# Altium project ControllerBoardExp.PrjPCB
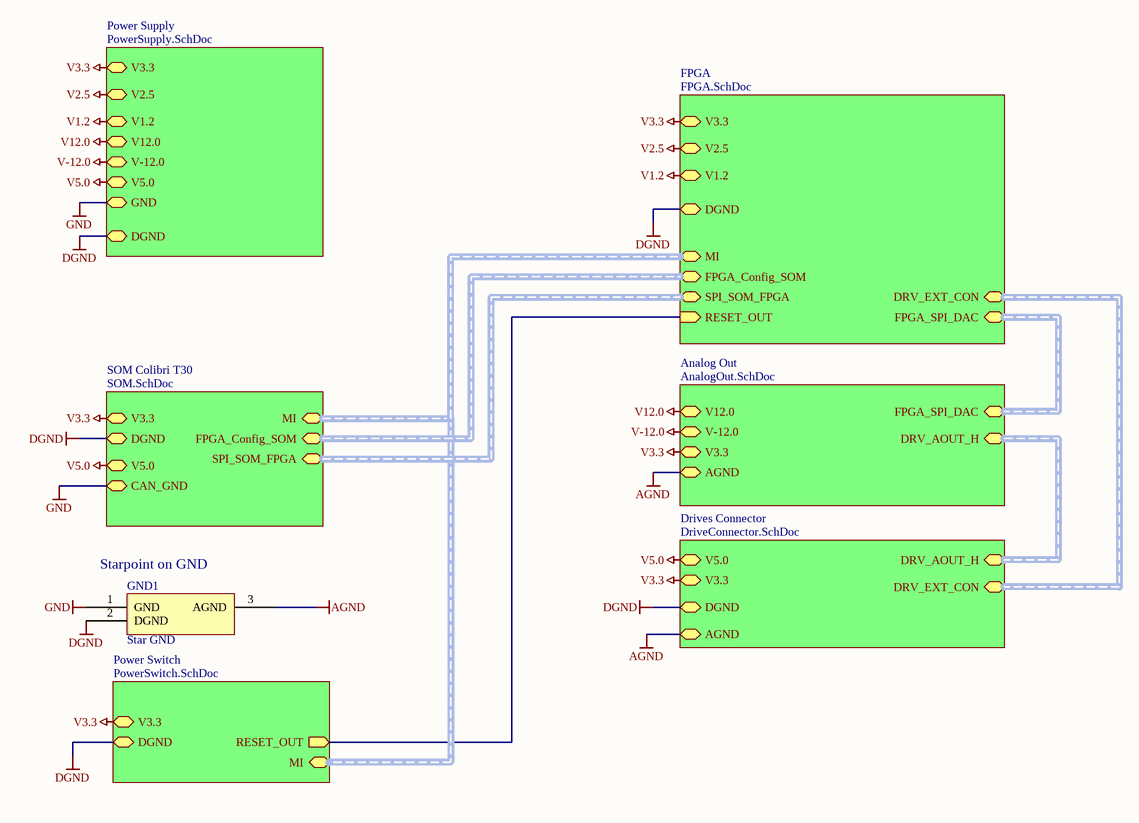
[diagram p0: ControllerBoardExp.SchDoc]
11 sheets, 166 parts. Net scope: strictly hierarchical (ports join the sheet entries above them; power ports are local).
Board file: ControllerBoardExp.PcbDoc
Sheets:
  ControllerBoardExp.SchDoc
    Power Supply = PowerSupply.SchDoc
    FPGA = FPGA.SchDoc
      FPGA_IO = FPGA_IO.SchDoc
      FPGA Config = FPGA_Config.SchDoc
    SOM Colibri T30 = SOM.SchDoc
      SOM CAN = SOM_CAN.SchDoc
      SOM USB = SOM_USB.SchDoc
    Analog Out = AnalogOut.SchDoc
      AnalogOut Level Shifter = AnalogOutLevelShifter.SchDoc
    Drives Connector = DriveConnector.SchDoc

## Sheet ControllerBoardExp.SchDoc: Main Schematic
size A4; Author: A. Kalberer; CompanyName: NTB; Organization: NTB Interstate University of Applied; Address1: Werdenbergstrasse 4; Address3: 9471 Buchs; Address4: Switzerland; Revision: 0.1; SheetNumber: 1; SheetTotal: 2; Organization1: Sciences of Technology Buchs; Size: A4

### Parts
GND1  Star GND  [NetTieGND]  (net tie, no BOM)

### Sub-sheets
Analog Out = AnalogOut.SchDoc: FPGA_SPI_DAC (harness FPGA_SPI_DAC), V12.0, V-12.0, AGND, V3.3, DRV_AOUT_H (harness DRV_AOUT_H)
Drives Connector = DriveConnector.SchDoc: DRV_EXT_CON (harness DRV_EXT_CON), DRV_AOUT_H (harness DRV_AOUT_H), V5.0, DGND, AGND, V3.3
FPGA = FPGA.SchDoc: V3.3, V2.5, V1.2, DGND (bidir), MI (harness MI), FPGA_Config_SOM (harness FPGA_Config_SOM), RESET_OUT (in), SPI_SOM_FPGA (harness SPI_SOM_FPGA), FPGA_SPI_DAC (harness FPGA_SPI_DAC), DRV_EXT_CON (harness DRV_EXT_CON)
Power Supply = PowerSupply.SchDoc: GND, V1.2, V2.5, V3.3, V5.0, V12.0, V-12.0, DGND
Power Switch = PowerSwitch.SchDoc (file not in this document): V3.3, DGND, MI (harness MI), RESET_OUT (out)
SOM Colibri T30 = SOM.SchDoc: V3.3, DGND (bidir), MI (harness MI), FPGA_Config_SOM (harness FPGA_Config_SOM), SPI_SOM_FPGA (harness SPI_SOM_FPGA), V5.0, CAN_GND

### Nets
AGND: GND1.3(AGND) ; sheet Analog Out/AGND, sheet Drives Connector/AGND
DGND: GND1.2(DGND) ; sheet Power Supply/DGND, sheet FPGA/DGND, sheet SOM Colibri T30/DGND, sheet Power Switch/DGND, sheet Drives Connector/DGND
GND: GND1.1(GND) ; sheet Power Supply/GND, sheet SOM Colibri T30/CAN_GND  [project net CAN_GND]
V1.2: sheet Power Supply/V1.2, sheet FPGA/V1.2
V2.5: sheet Power Supply/V2.5, sheet FPGA/V2.5
V3.3: sheet Power Supply/V3.3, sheet FPGA/V3.3, sheet SOM Colibri T30/V3.3, sheet Power Switch/V3.3, sheet Analog Out/V3.3, sheet Drives Connector/V3.3
V5.0: sheet Power Supply/V5.0, sheet SOM Colibri T30/V5.0, sheet Drives Connector/V5.0
V12.0: sheet Power Supply/V12.0, sheet Analog Out/V12.0
V-12.0: sheet Power Supply/V-12.0, sheet Analog Out/V-12.0
RESET_OUT: sheet FPGA/RESET_OUT, sheet Power Switch/RESET_OUT

### Buses and harness runs
harness sheet Analog Out/DRV_AOUT_H = sheet Drives Connector/DRV_AOUT_H
harness sheet Analog Out/FPGA_SPI_DAC = sheet FPGA/FPGA_SPI_DAC
harness sheet Drives Connector/DRV_EXT_CON = sheet FPGA/DRV_EXT_CON
harness sheet FPGA/FPGA_Config_SOM = sheet SOM Colibri T30/FPGA_Config_SOM
harness sheet FPGA/MI = sheet Power Switch/MI = sheet SOM Colibri T30/MI
harness sheet FPGA/SPI_SOM_FPGA = sheet SOM Colibri T30/SPI_SOM_FPGA

### Notes on the sheet
- (near GND1) Starpoint on GND
- Title:
- Description:
- Size:
- Date:
- Name:
- Number:
- Time:
- Revision:
- Sheet
- Checked:
- of
- File:

### Library data of the parts
GND1 = NetTie

## Sheet PowerSupply.SchDoc: Power Supply Main PCB
size A4; Author: A. Kalberer; CompanyName: NTB; Organization: NTB Interstate University of Applied; Address1: Werdenbergstrasse 4; Address3: 9471 Buchs; Address4: Switzerland; Revision: 0.1; SheetNumber: 2; SheetTotal: 2; Organization1: Sciences of Technology Buchs; Size: A4; ShortDescription: Power Supply
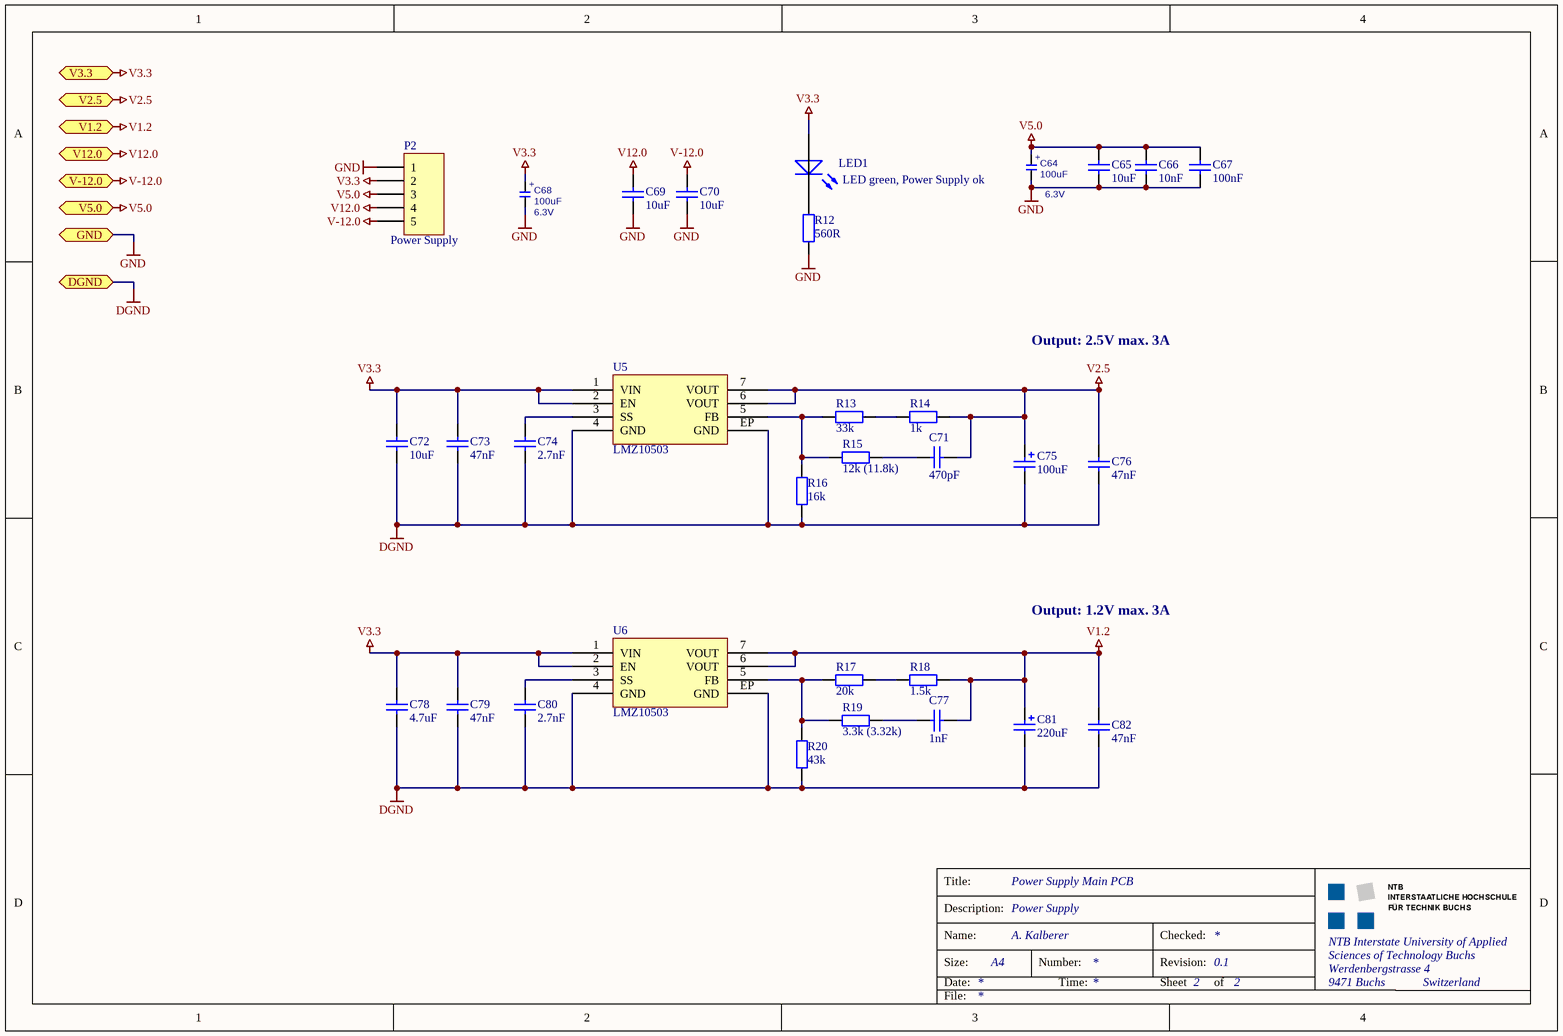
[diagram p1: PowerSupply.SchDoc]

### Parts
C64  Rating: 6.3V  [1206_Pol]  (hidden comment: 100uF)
C65  10uF  [1206]
C66  10nF  [0603_3D]
C67  100nF  [0603_3D]
C68  Rating: 6.3V  [1206_Pol]  (hidden comment: 100uF)
C69  10uF  [1206]
C70  10uF  [1206]
C71  470pF  [0603_3D]
C72  10uF  [1206]
C73  47nF  [0603_3D]
C74  2.7nF  [0603_3D]
C75  100uF  [1812_Pol]
C76  47nF  [0603_3D]
C77  1nF  [0603_3D]
C78  4.7uF  [1206]
C79  47nF  [0603_3D]
C80  2.7nF  [0603_3D]
C81  220uF  [CC-Type-B-3528]
C82  47nF  [0603_3D]
LED1  LED green, Power Supply ok  [0805]
P2  Power Supply  [Header - 1x5 - H]
R12  560R  [0603_3D]
R13  33k  [0603_3D]
R14  1k  [0603_3D]
R15  12k (11.8k)  [0603_3D]
R16  16k  [0603_3D]
R17  20k  [0603_3D]
R18  1.5k  [0603_3D]
R19  3.3k (3.32k)  [0603_3D]
R20  43k  [0603_3D]
U5  LMZ10503  [TZA07A]
U6  LMZ10503  [TZA07A]

### Ports
DGND, GND, V1.2, V2.5, V3.3, V5.0, V12.0, V-12.0

### Nets
DGND: C72.1 C73.1 C74.1 C75.2(Neg) C76.1 C78.1 C79.1 C80.1 C81.2(Neg) C82.1 R16.2 R20.2 U5.4(GND) U5.EP(GND) U6.4(GND) U6.EP(GND) ; port DGND
GND: C64.2 C65.1 C66.1 C67.1 C68.2 C69.1 C70.1 P2.1 R12.1 ; port GND  [project net CAN_GND]
V1.2: C77.1 C81.1(Pos) C82.2 R18.2 U6.6(VOUT) U6.7(VOUT) ; port V1.2
V2.5: C71.1 C75.1(Pos) C76.2 R14.2 U5.6(VOUT) U5.7(VOUT) ; port V2.5
V3.3: C68.1 C72.2 C73.2 C78.2 C79.2 LED1.2(A) P2.2 U5.1(VIN) U5.2(EN) U6.1(VIN) U6.2(EN) ; port V3.3
V5.0: C64.1 C65.2 C66.2 C67.2 P2.3 ; port V5.0
V12.0: C69.2 P2.4 ; port V12.0
V-12.0: C70.2 P2.5 ; port V-12.0
NetC71_2: C71.2 R15.2
NetC74_2: C74.2 U5.3(SS)
NetC77_2: C77.2 R19.2
NetC80_2: C80.2 U6.3(SS)
NetLED1_1: LED1.1(K) R12.2
NetR13_1: R13.1 R15.1 R16.1 U5.5(FB)
NetR13_2: R13.2 R14.1
NetR17_1: R17.1 R19.1 R20.1 U6.5(FB)
NetR17_2: R17.2 R18.1

### Notes on the sheet
- Output: 2.5V max. 3A
- Output: 1.2V max. 3A
- Title:
- Description:
- Size:
- Date:
- Name:
- Number:
- Time:
- Revision:
- Sheet
- Checked:
- of
- File:
- (in symbol C-TA-100uF-10V-20%-3528) +

### Library data of the parts
C64 C68 = C-TA-100uF-10V-20%-3528: Capacitor TA 100uF 10V 20% 3528; Manufacturer: Generic; Tolerance: 20%; Type: TA; Value: 100uF; Manufacturer Part Number: *
C65 C69 C70 C72 C78 = C: Capacitor; #Manufacturer: Generic Components; #Publisher: Dr. A. Heinzelmann; #Class: Passive; Initial Voltage: 0V; Type: Ceramic; #Published: 2006-10-07; #ClassSub: Capacitor; Voltage Maximum: *
  C65 C69 C70 C72: Value: 10uF
  C78: Value: 4.7uF
C66 C67 C71 C73 C74 C76 C77 C79 C80 C82 = C: Capacitor; #Manufacturer: Generic Components; #Publisher: Dr. A. Heinzelmann; #Class: Passive; Initial Voltage: 0V; #Published: 2006-10-07; #ClassSub: Capacitor; Type: *; Voltage Maximum: *
  C66: Value: 10nF
  C67: Value: 100nF
  C71: Value: 470pF
  C73 C76 C79 C82: Value: 47nF
  C74 C80: Value: 2.7nF
  C77: Value: 1nF
C75 C81 = C_POL: Polarized Capacitor Positive Mark Bar; #Manufacturer: Generic Components; #Publisher: Dr. A. Heinzelmann; #Class: Passive; Initial Voltage: 0V; Type: Tantal; #Published: 2006-10-07; #ClassSub: Capacitor; Voltage Maxium: *
  C75: Value: 100uF
  C81: Value: 220uF
LED1 = LED: Typical RED, GREEN, YELLOW, AMBER GaAs LED; #Manufacturer: Generic Components; #Publisher: Dr. A. Heinzelmann; #Class: Optoelectronic; #Published: 2006-10-31; #ClassSub: LED; Color: *; Type: *
P2 = Header 1x5: Header, 5-Pin; LatestRevisionDate: 17-Jul-2002; LatestRevisionNote: Re-released for DXP Platform.; Publisher: Altium Limited
R12-R20 = R: Resistor; #Manufacturer: Generic Components; #Publisher: Dr. A. Heinzelmann; #Class: Passive; #Published: 2006-10-06; #ClassSub: Resistor; Type: *
  R12: Value: 560R
  R13: Value: 33k
  R14: Value: 1k
  R15: Value: 12k (11.8k)
  R16: Value: 16k
  R17: Value: 20k
  R18: Value: 1.5k
  R19: Value: 3.3k (3.32k)
  R20: Value: 43k
U5 U6 = LMZ10503: Buck Converter

## Sheet FPGA.SchDoc: FPGA Overview
size A4; Author: A. Kalberer; CompanyName: NTB; Organization: NTB Interstate University of Applied; Address1: Werdenbergstrasse 4; Address3: 9471 Buchs; Address4: Switzerland; Revision: 0.1; Organization1: Sciences of Technology Buchs; Size: A4
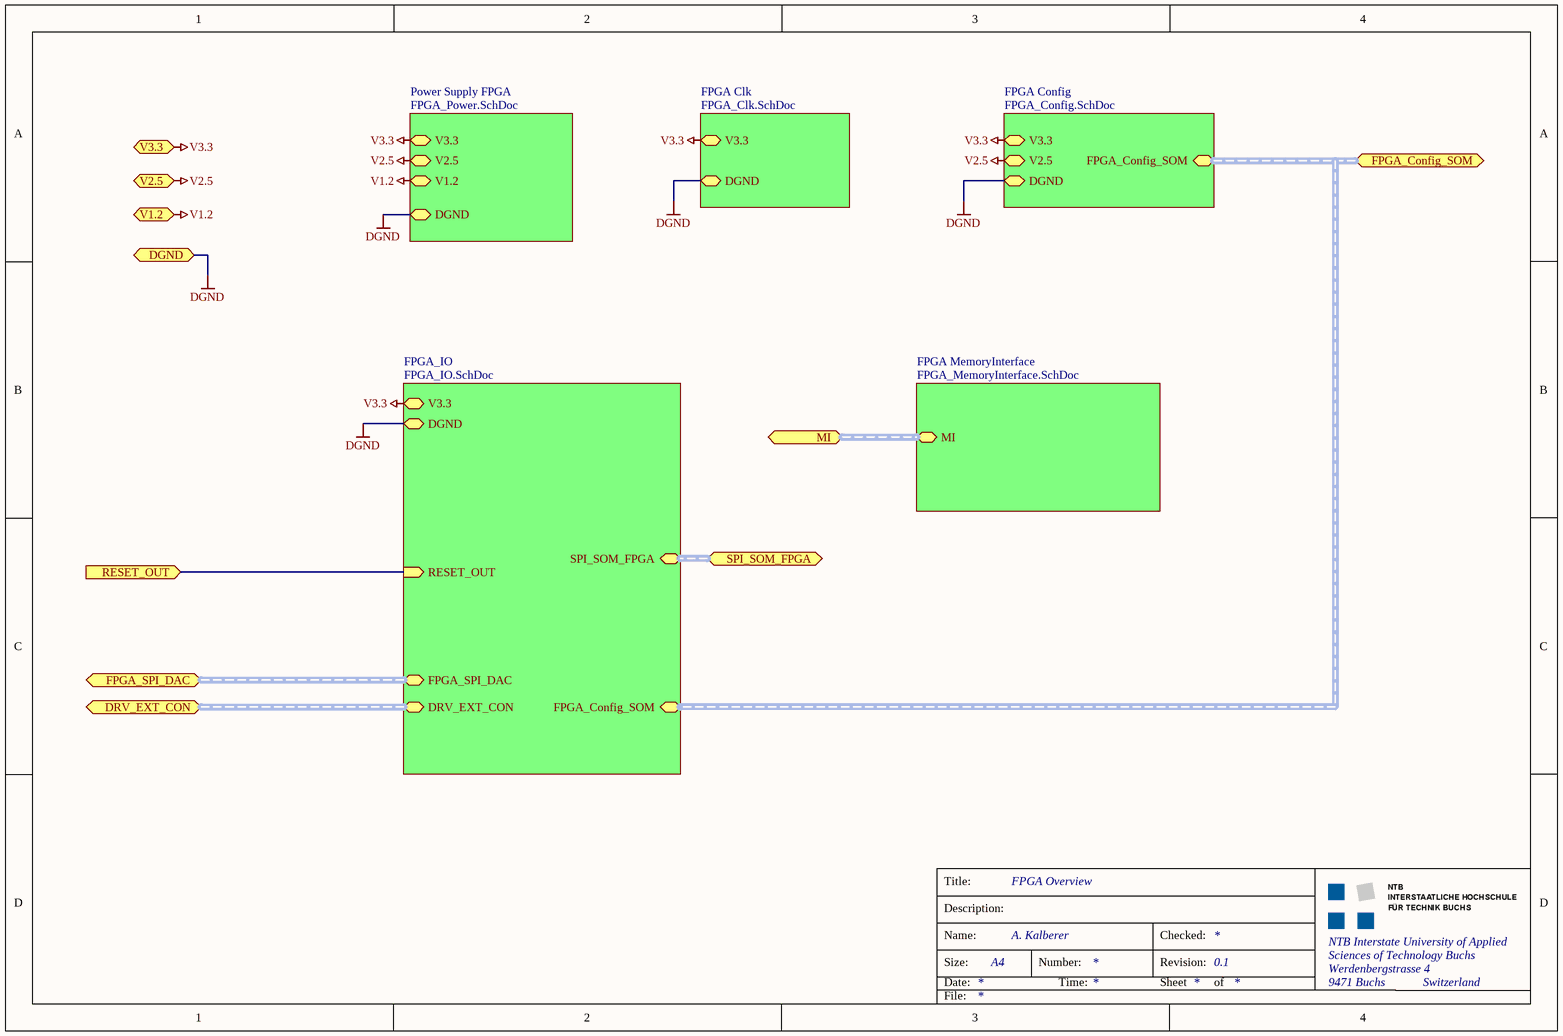
[diagram p2: FPGA.SchDoc]

### Sub-sheets
FPGA Clk = FPGA_Clk.SchDoc (file not in this document): V3.3, DGND
FPGA Config = FPGA_Config.SchDoc: V3.3, DGND, V2.5, FPGA_Config_SOM (harness FPGA_Config_SOM)
FPGA MemoryInterface = FPGA_MemoryInterface.SchDoc (file not in this document): MI (harness MI)
FPGA_IO = FPGA_IO.SchDoc: RESET_OUT (in), SPI_SOM_FPGA (harness SPI_SOM_FPGA), FPGA_Config_SOM (harness FPGA_Config_SOM), FPGA_SPI_DAC (harness FPGA_SPI_DAC), V3.3, DGND, DRV_EXT_CON (harness DRV_EXT_CON)
Power Supply FPGA = FPGA_Power.SchDoc (file not in this document): V3.3, V2.5, V1.2, DGND

### Ports
DGND, DRV_EXT_CON (harness DRV_EXT_CON), FPGA_Config_SOM (harness FPGA_Config_SOM), FPGA_SPI_DAC (harness FPGA_SPI_DAC), MI (harness MI), RESET_OUT (in), SPI_SOM_FPGA (harness SPI_SOM_FPGA), V1.2, V2.5, V3.3

### Nets
DGND: port DGND, sheet Power Supply FPGA/DGND, sheet FPGA Clk/DGND, sheet FPGA_IO/DGND, sheet FPGA Config/DGND
V1.2: port V1.2, sheet Power Supply FPGA/V1.2
V2.5: port V2.5, sheet Power Supply FPGA/V2.5, sheet FPGA Config/V2.5
V3.3: port V3.3, sheet Power Supply FPGA/V3.3, sheet FPGA Clk/V3.3, sheet FPGA_IO/V3.3, sheet FPGA Config/V3.3
RESET_OUT: port RESET_OUT, sheet FPGA_IO/RESET_OUT

### Buses and harness runs
harness port DRV_EXT_CON = sheet FPGA_IO/DRV_EXT_CON
harness port FPGA_Config_SOM = sheet FPGA Config/FPGA_Config_SOM = sheet FPGA_IO/FPGA_Config_SOM
harness port FPGA_SPI_DAC = sheet FPGA_IO/FPGA_SPI_DAC
harness port MI = sheet FPGA MemoryInterface/MI
harness port SPI_SOM_FPGA = sheet FPGA_IO/SPI_SOM_FPGA

### Notes on the sheet
- Title:
- Description:
- Size:
- Date:
- Name:
- Number:
- Time:
- Revision:
- Sheet
- Checked:
- of
- File:

## Sheet FPGA_IO.SchDoc: FPGA IO
size A3; Author: A. Kalberer; CompanyName: NTB; Organization: NTB Interstate University of Applied; Address1: Werdenbergstrasse 4; Address3: 9471 Buchs; Address4: Switzerland; Organization1: Sciences of Technology Buchs; Size: A3
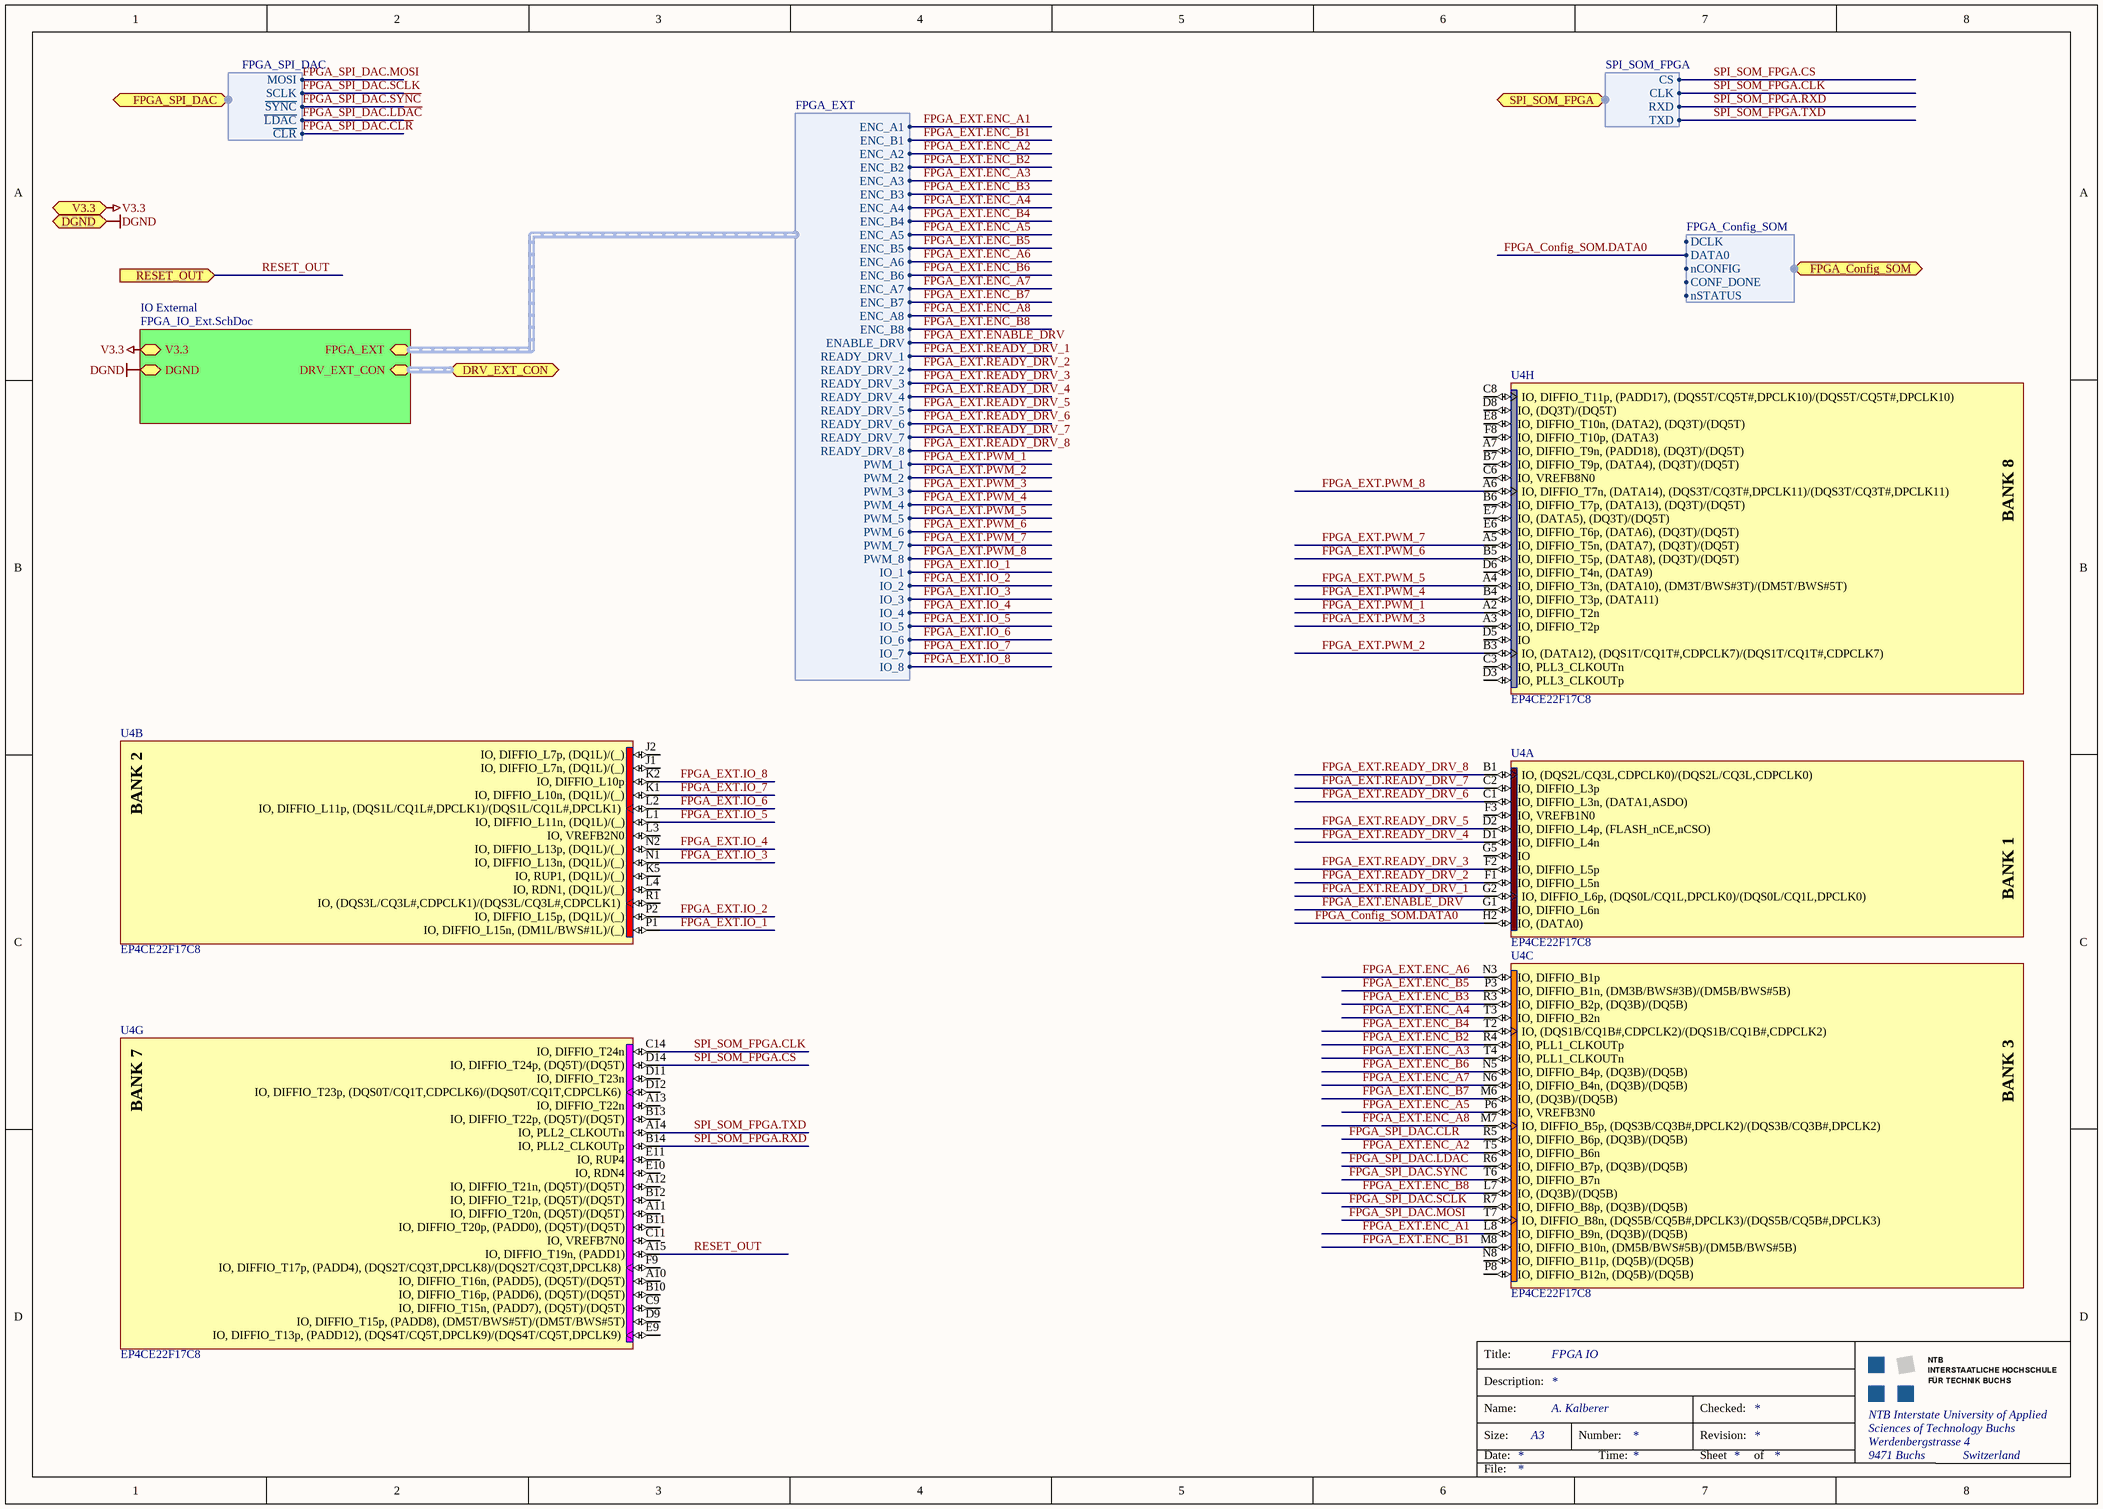
[diagram p3: FPGA_IO.SchDoc]

### Parts
U4  EP4CE22F17C8  [FBGA256]  (parts A,B,C,G,H of 13)

### Sub-sheets
IO External = FPGA_IO_Ext.SchDoc (file not in this document): V3.3, DGND, FPGA_EXT (harness FPGA_EXT), DRV_EXT_CON (harness DRV_EXT_CON)

### Ports
DGND, DRV_EXT_CON (harness DRV_EXT_CON), FPGA_Config_SOM (harness FPGA_Config_SOM), FPGA_SPI_DAC (harness FPGA_SPI_DAC), RESET_OUT (in), SPI_SOM_FPGA (harness SPI_SOM_FPGA), V3.3

### Harnesses
SPI_SOM_FPGA: CS, CLK, RXD, TXD
FPGA_Config_SOM: DCLK, DATA0, nCONFIG, CONF_DONE, nSTATUS
FPGA_SPI_DAC: MOSI, SCLK, ~{SYNC}, ~{LDAC}, ~{CLR}
FPGA_EXT: ENC_A1, ENC_B1, ENC_A2, ENC_B2, ENC_A3, ENC_B3, ENC_A4, ENC_B4, PWM_1, ENABLE_DRV, READY_DRV_4, READY_DRV_3, READY_DRV_2, READY_DRV_1, IO_1, IO_2, ENC_A5, ENC_B5, ENC_A6, ENC_B6, ENC_A7, ENC_B7, ENC_A8, ENC_B8, READY_DRV_5, READY_DRV_6, READY_DRV_7, READY_DRV_8, PWM_2, PWM_3, PWM_4, PWM_5, PWM_6, PWM_7, PWM_8, IO_3, IO_4, IO_5, IO_6, IO_7, IO_8

### Nets
DGND: port DGND, sheet IO External/DGND
V3.3: port V3.3, sheet IO External/V3.3
FPGA_Config_SOM.DATA0: U4.H2(IO,_(DATA0)) ; port FPGA_Config_SOM.DATA0
FPGA_EXT.ENABLE_DRV: U4.G1(IO,_DIFFIO_L6n) ; sheet IO External/FPGA_EXT.ENABLE_DRV
FPGA_EXT.ENC_A1: U4.L8(IO,_DIFFIO_B9n,_(DQ3B)/(DQ5B)) ; sheet IO External/FPGA_EXT.ENC_A1
FPGA_EXT.ENC_A2: U4.T5(IO,_DIFFIO_B6n) ; sheet IO External/FPGA_EXT.ENC_A2
FPGA_EXT.ENC_A3: U4.T4(IO,_PLL1_CLKOUTn) ; sheet IO External/FPGA_EXT.ENC_A3
FPGA_EXT.ENC_A4: U4.T3(IO,_DIFFIO_B2n) ; sheet IO External/FPGA_EXT.ENC_A4
FPGA_EXT.ENC_A5: U4.P6(IO,_VREFB3N0) ; sheet IO External/FPGA_EXT.ENC_A5
FPGA_EXT.ENC_A6: U4.N3(IO,_DIFFIO_B1p) ; sheet IO External/FPGA_EXT.ENC_A6
FPGA_EXT.ENC_A7: U4.N6(IO,_DIFFIO_B4n,_(DQ3B)/(DQ5B)) ; sheet IO External/FPGA_EXT.ENC_A7
FPGA_EXT.ENC_A8: U4.M7(IO,_DIFFIO_B5p,_(DQS3B/CQ3B#,DPCLK2)/(DQS3B/CQ3B#,DPCLK2)) ; sheet IO External/FPGA_EXT.ENC_A8
FPGA_EXT.ENC_B1: U4.M8(IO,_DIFFIO_B10n,_(DM5B/BWS#5B)/(DM5B/BWS#5B)) ; sheet IO External/FPGA_EXT.ENC_B1
FPGA_EXT.ENC_B2: U4.R4(IO,_PLL1_CLKOUTp) ; sheet IO External/FPGA_EXT.ENC_B2
FPGA_EXT.ENC_B3: U4.R3(IO,_DIFFIO_B2p,_(DQ3B)/(DQ5B)) ; sheet IO External/FPGA_EXT.ENC_B3
FPGA_EXT.ENC_B4: U4.T2(IO,_(DQS1B/CQ1B#,CDPCLK2)/(DQS1B/CQ1B#,CDPCLK2)) ; sheet IO External/FPGA_EXT.ENC_B4
FPGA_EXT.ENC_B5: U4.P3(IO,_DIFFIO_B1n,_(DM3B/BWS#3B)/(DM5B/BWS#5B)) ; sheet IO External/FPGA_EXT.ENC_B5
FPGA_EXT.ENC_B6: U4.N5(IO,_DIFFIO_B4p,_(DQ3B)/(DQ5B)) ; sheet IO External/FPGA_EXT.ENC_B6
FPGA_EXT.ENC_B7: U4.M6(IO,_(DQ3B)/(DQ5B)) ; sheet IO External/FPGA_EXT.ENC_B7
FPGA_EXT.ENC_B8: U4.L7(IO,_(DQ3B)/(DQ5B)) ; sheet IO External/FPGA_EXT.ENC_B8
FPGA_EXT.IO_1: U4.P1(IO,_DIFFIO_L15n,_(DM1L/BWS#1L)/(_)) ; sheet IO External/FPGA_EXT.IO_1
FPGA_EXT.IO_2: U4.P2(IO,_DIFFIO_L15p,_(DQ1L)/(_)) ; sheet IO External/FPGA_EXT.IO_2
FPGA_EXT.IO_3: U4.N1(IO,_DIFFIO_L13n,_(DQ1L)/(_)) ; sheet IO External/FPGA_EXT.IO_3
FPGA_EXT.IO_4: U4.N2(IO,_DIFFIO_L13p,_(DQ1L)/(_)) ; sheet IO External/FPGA_EXT.IO_4
FPGA_EXT.IO_5: U4.L1(IO,_DIFFIO_L11n,_(DQ1L)/(_)) ; sheet IO External/FPGA_EXT.IO_5
FPGA_EXT.IO_6: U4.L2(IO,_DIFFIO_L11p,_(DQS1L/CQ1L#,DPCLK1)/(DQS1L/CQ1L#,DPCLK1)) ; sheet IO External/FPGA_EXT.IO_6
FPGA_EXT.IO_7: U4.K1(IO,_DIFFIO_L10n,_(DQ1L)/(_)) ; sheet IO External/FPGA_EXT.IO_7
FPGA_EXT.IO_8: U4.K2(IO,_DIFFIO_L10p) ; sheet IO External/FPGA_EXT.IO_8
FPGA_EXT.PWM_1: U4.A2(IO,_DIFFIO_T2n) ; sheet IO External/FPGA_EXT.PWM_1
FPGA_EXT.PWM_2: U4.B3(IO,_(DATA12),_(DQS1T/CQ1T#,CDPCLK7)/(DQS1T/CQ1T#,CDPCLK7)) ; sheet IO External/FPGA_EXT.PWM_2
FPGA_EXT.PWM_3: U4.A3(IO,_DIFFIO_T2p) ; sheet IO External/FPGA_EXT.PWM_3
FPGA_EXT.PWM_4: U4.B4(IO,_DIFFIO_T3p,_(DATA11)) ; sheet IO External/FPGA_EXT.PWM_4
FPGA_EXT.PWM_5: U4.A4(IO,_DIFFIO_T3n,_(DATA10),_(DM3T/BWS#3T)/(DM5T/BWS#5T)) ; sheet IO External/FPGA_EXT.PWM_5
FPGA_EXT.PWM_6: U4.B5(IO,_DIFFIO_T5p,_(DATA8),_(DQ3T)/(DQ5T)) ; sheet IO External/FPGA_EXT.PWM_6
FPGA_EXT.PWM_7: U4.A5(IO,_DIFFIO_T5n,_(DATA7),_(DQ3T)/(DQ5T)) ; sheet IO External/FPGA_EXT.PWM_7
FPGA_EXT.PWM_8: U4.A6(IO,_DIFFIO_T7n,_(DATA14),_(DQS3T/CQ3T#,DPCLK11)/(DQS3T/CQ3T#,DPCLK11)) ; sheet IO External/FPGA_EXT.PWM_8
FPGA_EXT.READY_DRV_1: U4.G2(IO,_DIFFIO_L6p,_(DQS0L/CQ1L,DPCLK0)/(DQS0L/CQ1L,DPCLK0)) ; sheet IO External/FPGA_EXT.READY_DRV_1
FPGA_EXT.READY_DRV_2: U4.F1(IO,_DIFFIO_L5n) ; sheet IO External/FPGA_EXT.READY_DRV_2
FPGA_EXT.READY_DRV_3: U4.F2(IO,_DIFFIO_L5p) ; sheet IO External/FPGA_EXT.READY_DRV_3
FPGA_EXT.READY_DRV_4: U4.D1(IO,_DIFFIO_L4n) ; sheet IO External/FPGA_EXT.READY_DRV_4
FPGA_EXT.READY_DRV_5: U4.D2(IO,_DIFFIO_L4p,_(FLASH_nCE,nCSO)) ; sheet IO External/FPGA_EXT.READY_DRV_5
FPGA_EXT.READY_DRV_6: U4.C1(IO,_DIFFIO_L3n,_(DATA1,ASDO)) ; sheet IO External/FPGA_EXT.READY_DRV_6
FPGA_EXT.READY_DRV_7: U4.C2(IO,_DIFFIO_L3p) ; sheet IO External/FPGA_EXT.READY_DRV_7
FPGA_EXT.READY_DRV_8: U4.B1(IO,_(DQS2L/CQ3L,CDPCLK0)/(DQS2L/CQ3L,CDPCLK0)) ; sheet IO External/FPGA_EXT.READY_DRV_8
FPGA_SPI_DAC.~{CLR}: U4.R5(IO,_DIFFIO_B6p,_(DQ3B)/(DQ5B)) ; port FPGA_SPI_DAC.~{CLR}
FPGA_SPI_DAC.~{LDAC}: U4.R6(IO,_DIFFIO_B7p,_(DQ3B)/(DQ5B)) ; port FPGA_SPI_DAC.~{LDAC}
FPGA_SPI_DAC.MOSI: U4.T7(IO,_DIFFIO_B8n,_(DQS5B/CQ5B#,DPCLK3)/(DQS5B/CQ5B#,DPCLK3)) ; port FPGA_SPI_DAC.MOSI
FPGA_SPI_DAC.~{SYNC}: U4.T6(IO,_DIFFIO_B7n) ; port FPGA_SPI_DAC.~{SYNC}
FPGA_SPI_DAC.SCLK: U4.R7(IO,_DIFFIO_B8p,_(DQ3B)/(DQ5B)) ; port FPGA_SPI_DAC.SCLK
RESET_OUT: U4.A15(IO,_DIFFIO_T19n,_(PADD1)) ; port RESET_OUT
SPI_SOM_FPGA.CLK: U4.C14(IO,_DIFFIO_T24n) ; port SPI_SOM_FPGA.CLK
SPI_SOM_FPGA.CS: U4.D14(IO,_DIFFIO_T24p,_(DQ5T)/(DQ5T)) ; port SPI_SOM_FPGA.CS
SPI_SOM_FPGA.RXD: U4.B14(IO,_PLL2_CLKOUTp) ; port SPI_SOM_FPGA.RXD
SPI_SOM_FPGA.TXD: U4.A14(IO,_PLL2_CLKOUTn) ; port SPI_SOM_FPGA.TXD

Not connected (* = marked no-connect by the designer): U4 A7(IO,_DIFFIO_T9n,_(PADD18),_(DQ3T)/(DQ5T)) A10(IO,_DIFFIO_T16n,_(PADD5),_(DQ5T)/(DQ5T)) A11(IO,_DIFFIO_T20n,_(DQ5T)/(DQ5T)) A12(IO,_DIFFIO_T21n,_(DQ5T)/(DQ5T)) A13(IO,_DIFFIO_T22n) B6(IO,_DIFFIO_T7p,_(DATA13),_(DQ3T)/(DQ5T)) B7(IO,_DIFFIO_T9p,_(DATA4),_(DQ3T)/(DQ5T)) B10(IO,_DIFFIO_T16p,_(PADD6),_(DQ5T)/(DQ5T)) B11(IO,_DIFFIO_T20p,_(PADD0),_(DQ5T)/(DQ5T)) B12(IO,_DIFFIO_T21p,_(DQ5T)/(DQ5T)) B13(IO,_DIFFIO_T22p,_(DQ5T)/(DQ5T)) C3(IO,_PLL3_CLKOUTn) C6(IO,_VREFB8N0) C8(IO,_DIFFIO_T11p,_(PADD17),_(DQS5T/CQ5T#,DPCLK10)/(DQS5T/CQ5T#,DPCLK10)) C9(IO,_DIFFIO_T15n,_(PADD7),_(DQ5T)/(DQ5T)) C11(IO,_VREFB7N0) D3(IO,_PLL3_CLKOUTp) D5(IO) D6(IO,_DIFFIO_T4n,_(DATA9)) D8(IO,_(DQ3T)/(DQ5T)) D9(IO,_DIFFIO_T15p,_(PADD8),_(DM5T/BWS#5T)/(DM5T/BWS#5T)) D11(IO,_DIFFIO_T23n) D12(IO,_DIFFIO_T23p,_(DQS0T/CQ1T,CDPCLK6)/(DQS0T/CQ1T,CDPCLK6)) E6(IO,_DIFFIO_T6p,_(DATA6),_(DQ3T)/(DQ5T)) E7(IO,_(DATA5),_(DQ3T)/(DQ5T)) E8(IO,_DIFFIO_T10n,_(DATA2),_(DQ3T)/(DQ5T)) E9(IO,_DIFFIO_T13p,_(PADD12),_(DQS4T/CQ5T,DPCLK9)/(DQS4T/CQ5T,DPCLK9)) E10(IO,_RDN4) E11(IO,_RUP4) F3(IO,_VREFB1N0) F8(IO,_DIFFIO_T10p,_(DATA3)) F9(IO,_DIFFIO_T17p,_(PADD4),_(DQS2T/CQ3T,DPCLK8)/(DQS2T/CQ3T,DPCLK8)) G5(IO) J1(IO,_DIFFIO_L7n,_(DQ1L)/(_)) J2(IO,_DIFFIO_L7p,_(DQ1L)/(_)) K5(IO,_RUP1,_(DQ1L)/(_)) L3(IO,_VREFB2N0) L4(IO,_RDN1,_(DQ1L)/(_)) N8(IO,_DIFFIO_B11p,_(DQ5B)/(DQ5B)) P8(IO,_DIFFIO_B12n,_(DQ5B)/(DQ5B)) R1(IO,_(DQS3L/CQ3L#,CDPCLK1)/(DQS3L/CQ3L#,CDPCLK1))

### Buses and harness runs
harness port DRV_EXT_CON = sheet IO External/DRV_EXT_CON

### Notes on the sheet
- Title:
- Description:
- Size:
- Date:
- Name:
- Number:
- Time:
- Revision:
- Sheet
- Checked:
- of
- File:
- (in symbol EP4CE22F17C8, part A) BANK 1
- (in symbol EP4CE22F17C8, part B) BANK 2
- (in symbol EP4CE22F17C8, part C) BANK 3
- (in symbol EP4CE22F17C8, part G) BANK 7
- (in symbol EP4CE22F17C8, part H) BANK 8

### Library data of the parts
U4 = EP4CE22F17C8: Cyclone IV Family FPGA, 2V Core, 153 I/O Pins, 4 PLLs, 256-Pin FBGA, Speed Grade 8, Commercial Grade; Published: 3-May-2010; DatasheetVersion: ver1.2, Mar-2010; PackageVersion: ver16.0, Dec-2009; PackageReference: FBGA256; Publisher: Altium Limited; PackageDescription: 256-Ball FineLine Ball Grid Array (FBGA256) - Option 1 - Wire Bond; Supplier 1: Digi-Key; Supplier Part Number 1: EP4CE22F17C8-ND; Code_JEDEC: MS-034-AAF-1; Code_IPC: BGA100P16X16-256; ComponentLink1Description: Manufacturer Link; ComponentLink1URL: http://www.altera.com/; ComponentLink2Description: Handbook; ComponentLink2URL: http://www.altera.com/literature/hb/cyclone-iv/cyclone4-handbook.pdf; ComponentLink3Description: Pinout Specification; ComponentLink3URL: http://www.altera.com/literature/lit-dp.jsp?category=cyc%204&showspreadsheet=y; ComponentLink4Description: Packaging Specification; ComponentLink4URL: http://www.altera.com/literature/ds/dspkg.pdf

## Sheet FPGA_Config.SchDoc: FPGA Config
size A4; Author: A. Kalberer; CompanyName: NTB; Organization: NTB Interstate University of Applied; Address1: Werdenbergstrasse 4; Address3: 9471 Buchs; Address4: Switzerland; Organization1: Sciences of Technology Buchs; Size: A4
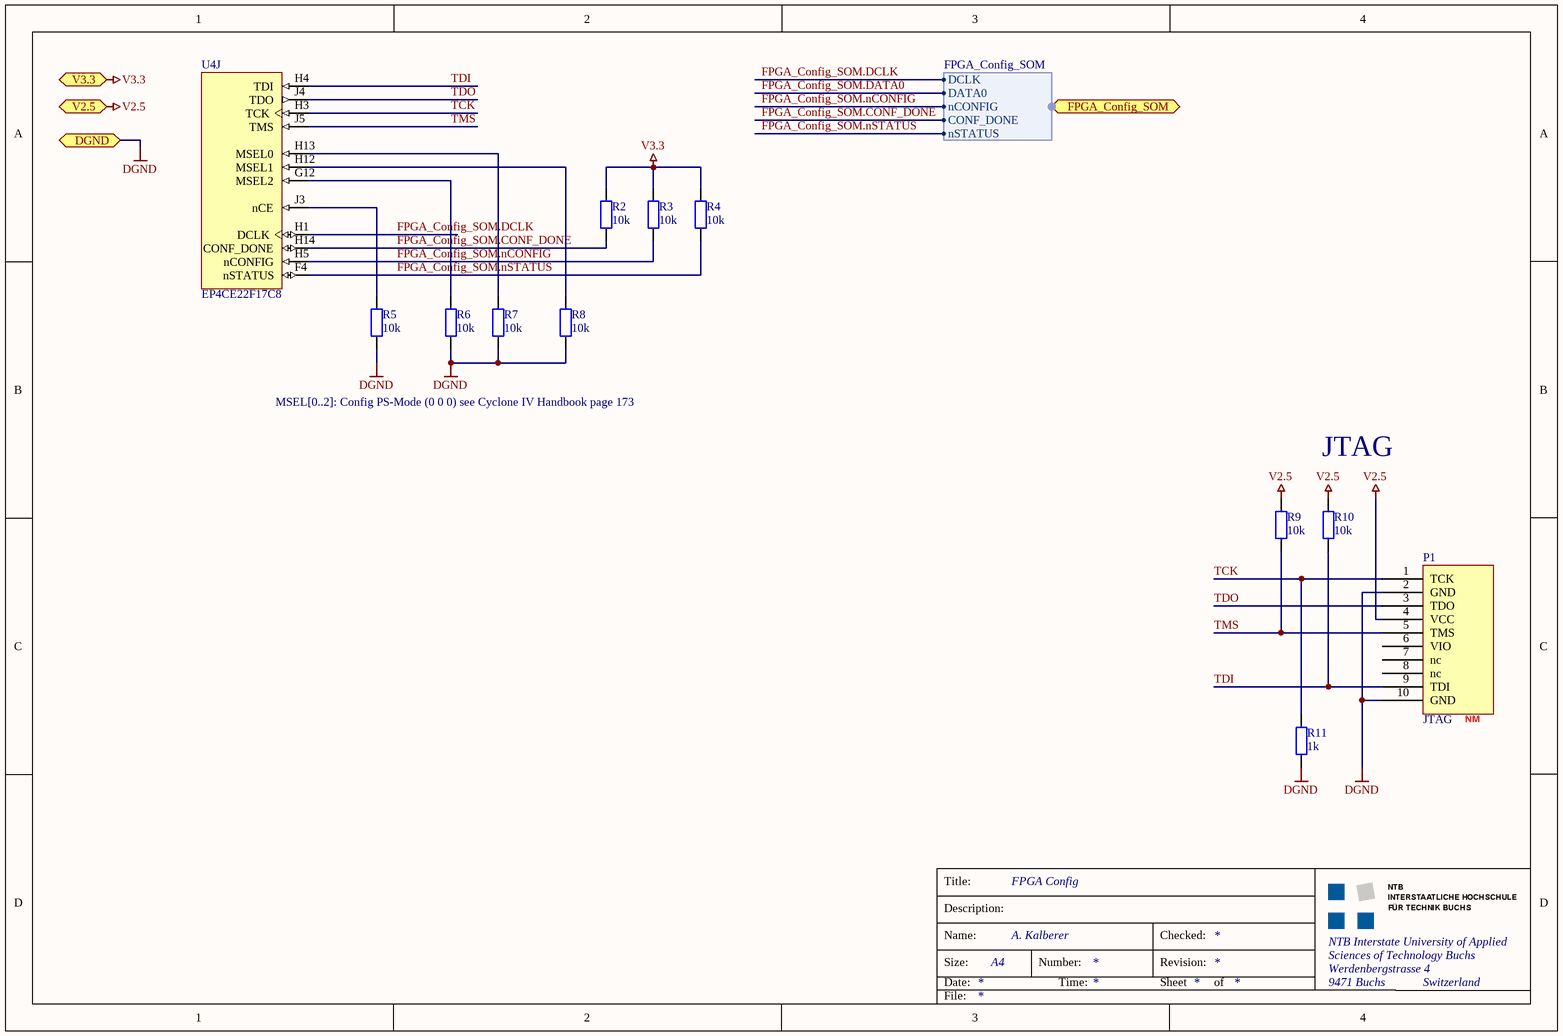
[diagram p4: FPGA_Config.SchDoc]

### Parts
P1  JTAG  [MicroMatch_10PinSMD]
R2  10k  [0603_3D]
R3  10k  [0603_3D]
R4  10k  [0603_3D]
R5  10k  [0603_3D]
R6  10k  [0603_3D]
R7  10k  [0603_3D]
R8  10k  [0603_3D]
R9  10k  [0603_3D]
R10  10k  [0603_3D]
R11  1k  [0603_3D]
U4  EP4CE22F17C8  [FBGA256]  (part J of 13)

### Ports
DGND, FPGA_Config_SOM (harness FPGA_Config_SOM), V2.5, V3.3

### Harnesses
FPGA_Config_SOM: DCLK, DATA0, nCONFIG, CONF_DONE, nSTATUS

### Nets
DGND: P1.2(GND) P1.10(GND) R5.1 R6.1 R7.1 R8.2 R11.1 ; port DGND
V2.5: P1.4(VCC) R9.2 R10.2 ; port V2.5
V3.3: R2.2 R3.2 R4.2 ; port V3.3
FPGA_Config_SOM.CONF_DONE: R2.1 U4.H14(CONF_DONE) ; port FPGA_Config_SOM.CONF_DONE
FPGA_Config_SOM.DCLK: U4.H1(DCLK) ; port FPGA_Config_SOM.DCLK
FPGA_Config_SOM.nCONFIG: R3.1 U4.H5(nCONFIG) ; port FPGA_Config_SOM.nCONFIG
FPGA_Config_SOM.nSTATUS: R4.1 U4.F4(nSTATUS) ; port FPGA_Config_SOM.nSTATUS
TCK: P1.1(TCK) R11.2 U4.H3(TCK)
TDI: P1.9(TDI) R10.1 U4.H4(TDI)
TDO: P1.3(TDO) U4.J4(TDO)
TMS: P1.5(TMS) R9.1 U4.J5(TMS)
NetR5_2: R5.2 U4.J3(nCE)
NetR6_2: R6.2 U4.G12(MSEL2)
NetR7_2: R7.2 U4.H13(MSEL0)
NetR8_1: R8.1 U4.H12(MSEL1)

Not connected (* = marked no-connect by the designer): P1 6(VIO) 7(nc) 8(nc)

### Notes on the sheet
- MSEL[0..2]: Config PS-Mode (0 0 0) see Cyclone IV Handbook page 173
- JTAG
- (near P1) NM
- Title:
- Description:
- Size:
- Date:
- Name:
- Number:
- Time:
- Revision:
- Sheet
- Checked:
- of
- File:

### Library data of the parts
P1 = AlteraJTAG: Altera JTAG
R2-R11 = R: as R12 on sheet PowerSupply; #Published: 2006-10-06; #ClassSub: Resistor; Type: *
  R2-R10: Value: 10k
  R11: Value: 1k
U4 = EP4CE22F17C8: as U4 on sheet FPGA_IO; Published: 3-May-2010; DatasheetVersion: ver1.2, Mar-2010; PackageVersion: ver16.0, Dec-2009; PackageReference: FBGA256; Publisher: Altium Limited; PackageDescription: 256-Ball FineLine Ball Grid Array (FBGA256) - Option 1 - Wire Bond; Supplier 1: Digi-Key; Supplier Part Number 1: EP4CE22F17C8-ND; Code_JEDEC: MS-034-AAF-1; Code_IPC: BGA100P16X16-256; ComponentLink1Description: Manufacturer Link; ComponentLink1URL: http://www.altera.com/; ComponentLink2Description: Handbook; ComponentLink2URL: http://www.altera.com/literature/hb/cyclone-iv/cyclone4-handbook.pdf; ComponentLink3Description: Pinout Specification; ComponentLink3URL: http://www.altera.com/literature/lit-dp.jsp?category=cyc%204&showspreadsheet=y; ComponentLink4Description: Packaging Specification; ComponentLink4URL: http://www.altera.com/literature/ds/dspkg.pdf

## Sheet SOM.SchDoc: SOM Main Schematic
size A4; Author: A. Kalberer; CompanyName: NTB; Organization: NTB Interstate University of Applied; Address1: Werdenbergstrasse 4; Address3: 9471 Buchs; Address4: Switzerland; Organization1: Sciences of Technology Buchs; Size: A4
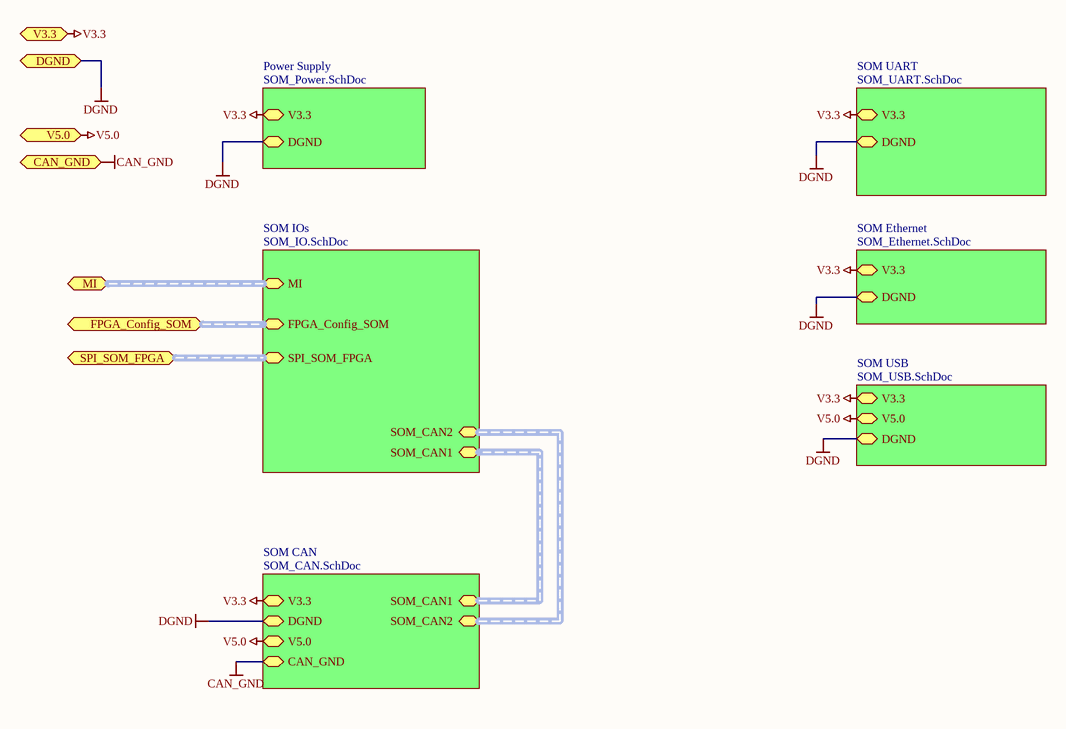
[diagram p5: SOM.SchDoc]

### Sub-sheets
Power Supply = SOM_Power.SchDoc (file not in this document): V3.3, DGND
SOM CAN = SOM_CAN.SchDoc: V3.3, DGND, V5.0, CAN_GND, SOM_CAN1 (harness SOM_CAN1), SOM_CAN2 (harness SOM_CAN2)
SOM Ethernet = SOM_Ethernet.SchDoc (file not in this document): DGND, V3.3
SOM IOs = SOM_IO.SchDoc (file not in this document): MI (harness MI), FPGA_Config_SOM (harness FPGA_Config_SOM), SPI_SOM_FPGA (harness SPI_SOM_FPGA), SOM_CAN1 (harness SOM_CAN1), SOM_CAN2 (harness SOM_CAN2)
SOM UART = SOM_UART.SchDoc (file not in this document): V3.3, DGND
SOM USB = SOM_USB.SchDoc: V3.3, V5.0, DGND

### Ports
CAN_GND, DGND, FPGA_Config_SOM (harness FPGA_Config_SOM), MI (harness MI), SPI_SOM_FPGA (harness SPI_SOM_FPGA), V3.3, V5.0

### Nets
CAN_GND: port CAN_GND, sheet SOM CAN/CAN_GND
DGND: port DGND, sheet Power Supply/DGND, sheet SOM UART/DGND, sheet SOM Ethernet/DGND, sheet SOM CAN/DGND, sheet SOM USB/DGND
V3.3: port V3.3, sheet Power Supply/V3.3, sheet SOM UART/V3.3, sheet SOM Ethernet/V3.3, sheet SOM CAN/V3.3, sheet SOM USB/V3.3
V5.0: port V5.0, sheet SOM CAN/V5.0, sheet SOM USB/V5.0

### Buses and harness runs
harness port FPGA_Config_SOM = sheet SOM IOs/FPGA_Config_SOM
harness port MI = sheet SOM IOs/MI
harness port SPI_SOM_FPGA = sheet SOM IOs/SPI_SOM_FPGA
harness sheet SOM CAN/SOM_CAN1 = sheet SOM IOs/SOM_CAN1
harness sheet SOM CAN/SOM_CAN2 = sheet SOM IOs/SOM_CAN2

### Notes on the sheet
- Title:
- Description:
- Size:
- Date:
- Name:
- Number:
- Time:
- Revision:
- Sheet
- Checked:
- of
- File:

## Sheet SOM_CAN.SchDoc
size A4; CompanyName: NTB; Organization: NTB Interstate University of Applied; Address1: Werdenbergstrasse 4; Address3: 9471 Buchs; Address4: Switzerland; Organization1: Sciences of Technology Buchs; Size: A4
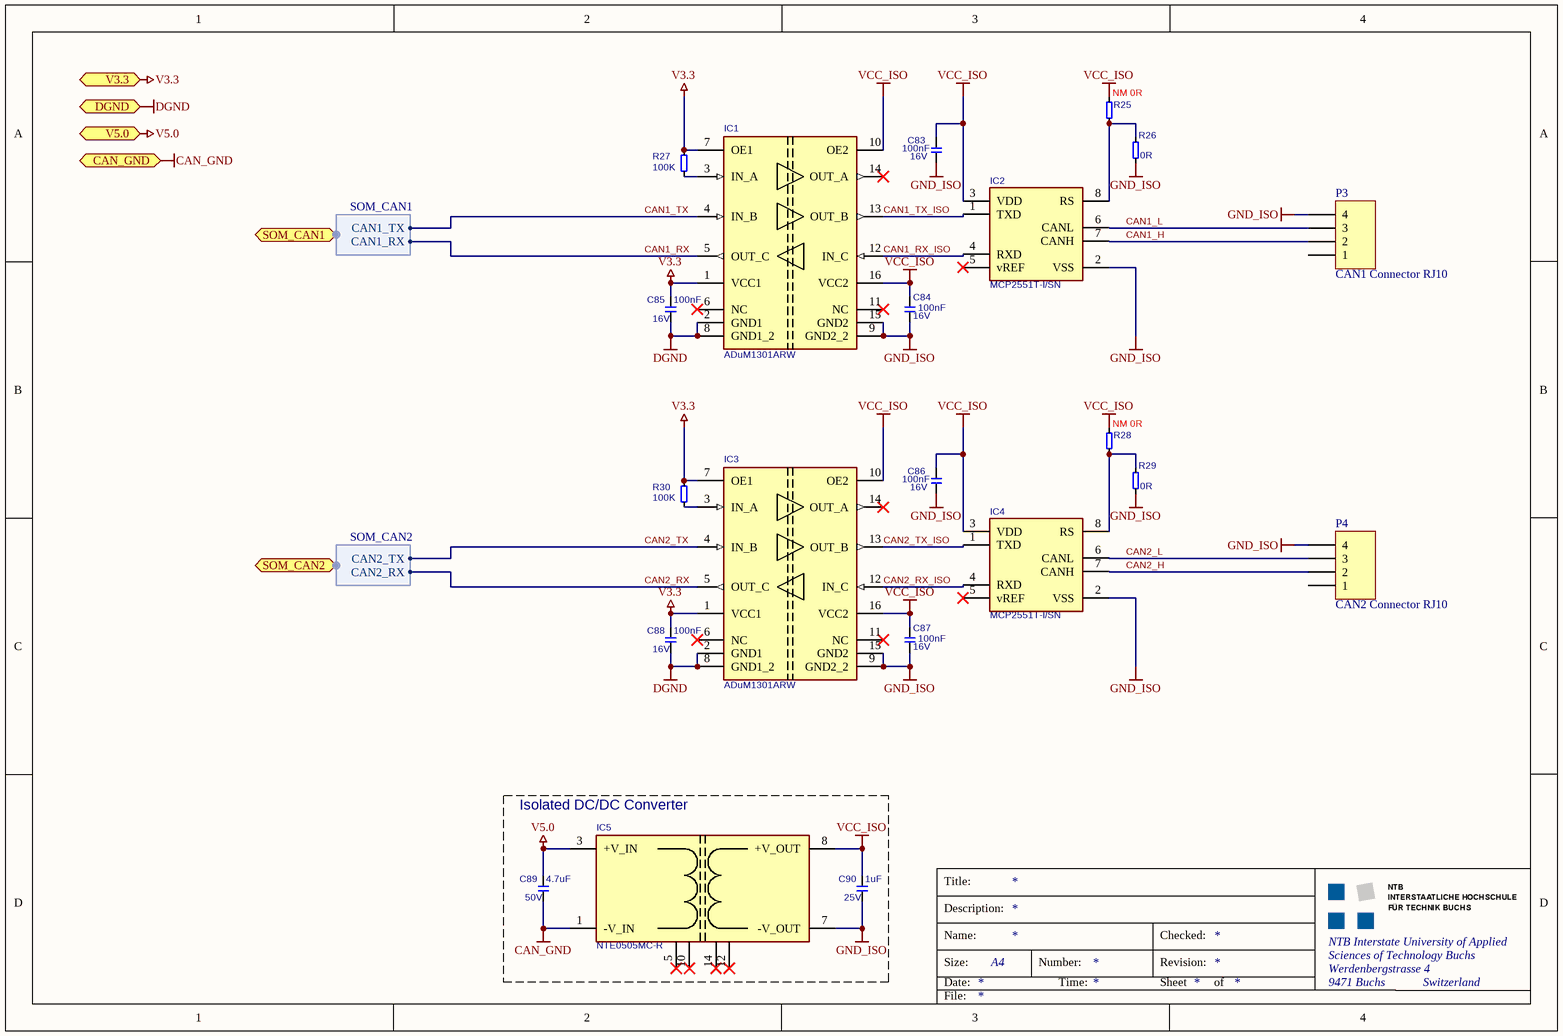
[diagram p6: SOM_CAN.SchDoc]

### Parts
C83  Rating: 16V  [0603_3D]  (hidden comment: 100nF)
C84  Rating: 16V  [0603_3D]  (hidden comment: 100nF)
C85  Rating: 16V  [0603_3D]  (hidden comment: 100nF)
C86  Rating: 16V  [0603_3D]  (hidden comment: 100nF)
C87  Rating: 16V  [0603_3D]  (hidden comment: 100nF)
C88  Rating: 16V  [0603_3D]  (hidden comment: 100nF)
C89  Rating: 50V  [1206]  (hidden comment: 4.7uF)
C90  Rating: 25V  [0603_3D]  (hidden comment: 1uF)
IC1  ADuM1301ARW  [T_AD_ADuM1300ARW]
IC2  MCP2551T-I/SN  [SOIC127P600X173-8N]
IC3  ADuM1301ARW  [T_AD_ADuM1300ARW]
IC4  MCP2551T-I/SN  [SOIC127P600X173-8N]
IC5  NTE0505MC-R  [T_MURATA_NTE0505MC-R]
P3  CAN1 Connector RJ10  [95009-2447]
P4  CAN2 Connector RJ10  [95009-2447]
R25  NM 0R  [0603_3D]
R26  0R  [0603_3D]
R27  100K  [0603_3D]
R28  NM 0R  [0603_3D]
R29  0R  [0603_3D]
R30  100K  [0603_3D]

### Blocks framed on the sheet
Isolated DC/DC Converter: C89 C90 IC5

### Ports
CAN_GND, DGND, SOM_CAN1 (harness SOM_CAN1), SOM_CAN2 (harness SOM_CAN2), V3.3, V5.0

### Harnesses
SOM_CAN1: CAN1_TX, CAN1_RX
SOM_CAN2: CAN2_TX, CAN2_RX

### Nets
CAN_GND: C89.1 IC5.1(-V_IN) ; port CAN_GND
DGND: C85.1 C88.1 IC1.2(GND1) IC1.8(GND1_2) IC3.2(GND1) IC3.8(GND1_2) ; port DGND
GND_ISO: C83.1 C84.1 C86.1 C87.1 C90.1 IC1.9(GND2_2) IC1.15(GND2) IC2.2(VSS) IC3.9(GND2_2) IC3.15(GND2) IC4.2(VSS) IC5.7(-V_OUT) P3.4 P4.4 R26.1 R29.1
V3.3: C85.2 C88.2 IC1.1(VCC1) IC1.7(OE1) IC3.1(VCC1) IC3.7(OE1) R27.2 R30.2 ; port V3.3
V5.0: C89.2 IC5.3(+V_IN) ; port V5.0
VCC_ISO: C83.2 C84.2 C86.2 C87.2 C90.2 IC1.10(OE2) IC1.16(VCC2) IC2.3(VDD) IC3.10(OE2) IC3.16(VCC2) IC4.3(VDD) IC5.8(+V_OUT) R25.2 R28.2
CAN1_H: IC2.7(CANH) P3.2
CAN1_L: IC2.6(CANL) P3.3
CAN1_RX: IC1.5(OUT_C) ; port SOM_CAN1.CAN1_RX
CAN1_RX_ISO: IC1.12(IN_C) IC2.4(RXD)
CAN1_TX: IC1.4(IN_B) ; port SOM_CAN1.CAN1_TX
CAN1_TX_ISO: IC1.13(OUT_B) IC2.1(TXD)
CAN2_H: IC4.7(CANH) P4.2
CAN2_L: IC4.6(CANL) P4.3
CAN2_RX: IC3.5(OUT_C) ; port SOM_CAN2.CAN2_RX
CAN2_RX_ISO: IC3.12(IN_C) IC4.4(RXD)
CAN2_TX: IC3.4(IN_B) ; port SOM_CAN2.CAN2_TX
CAN2_TX_ISO: IC3.13(OUT_B) IC4.1(TXD)
NetIC1_3: IC1.3(IN_A) R27.1
NetIC2_8: IC2.8(RS) R25.1 R26.2
NetIC3_3: IC3.3(IN_A) R30.1
NetIC4_8: IC4.8(RS) R28.1 R29.2

Not connected (* = marked no-connect by the designer): IC1 6(NC)* 11(NC)* 14(OUT_A)*; IC2 5(vREF)*; IC3 6(NC)* 11(NC)* 14(OUT_A)*; IC4 5(vREF)*; IC5 5(NC)* 10(NC)* 12(NC)* 14(NC)*; P3 1; P4 1

### Notes on the sheet
- Title:
- Description:
- Size:
- Date:
- Name:
- Number:
- Time:
- Revision:
- Sheet
- Checked:
- of
- File:

### Library data of the parts
C83-C90 = C-X7R-100nF-16V-10%-0603: Capacitor Ceramic X7R 100nF 16V 10% 0603; Tolerance: 10%; Type: X7R
  C83-C88: Value: 100nF
  C89: Value: 4.7uF
  C90: Value: 1uF
IC1 IC3 = IC-AD-ADuM1301ARW: Digital Isolator; Manufacturer Name: Analog Devices; Manufacturer Part No.: ADuM1301ARW
IC2 IC4 = IC-MC-MCP2551T-I/SN: High speed CAN Transceiver; Manufacturer Name: Microchip; Manufacturer Part No.: MCP2551T-I/SN
IC5 = IC-MUR-NTE0505MC-R: Isolated DC/DC Converter; Manufacturer Name: Murata; Manufacturer Part No.: NTE0505MC-R
P3 P4 = Header 4: Header, 4-Pin; LatestRevisionDate: 17-Jul-2002; LatestRevisionNote: Re-released for DXP Platform.; Publisher: Altium Limited
R25 R26 R28 R29 = R-0R-63mW-1%-0603: Resistor 0 ohm 63mW 1% 0603; Rating: 63mW; Tolerance: 1%; Value: 0R
R27 R30 = R-100KR-63mW-5%-0603: Resistor 100 Kohm 63mW 5% 0603; Value: 100KR; Rating: 63mW; Tolerance: 5%

## Sheet SOM_USB.SchDoc
size A3; CompanyName: NTB; Organization: NTB Interstate University of Applied; Address1: Werdenbergstrasse 4; Address3: 9471 Buchs; Address4: Switzerland; Organization1: Sciences of Technology Buchs; Size: A3
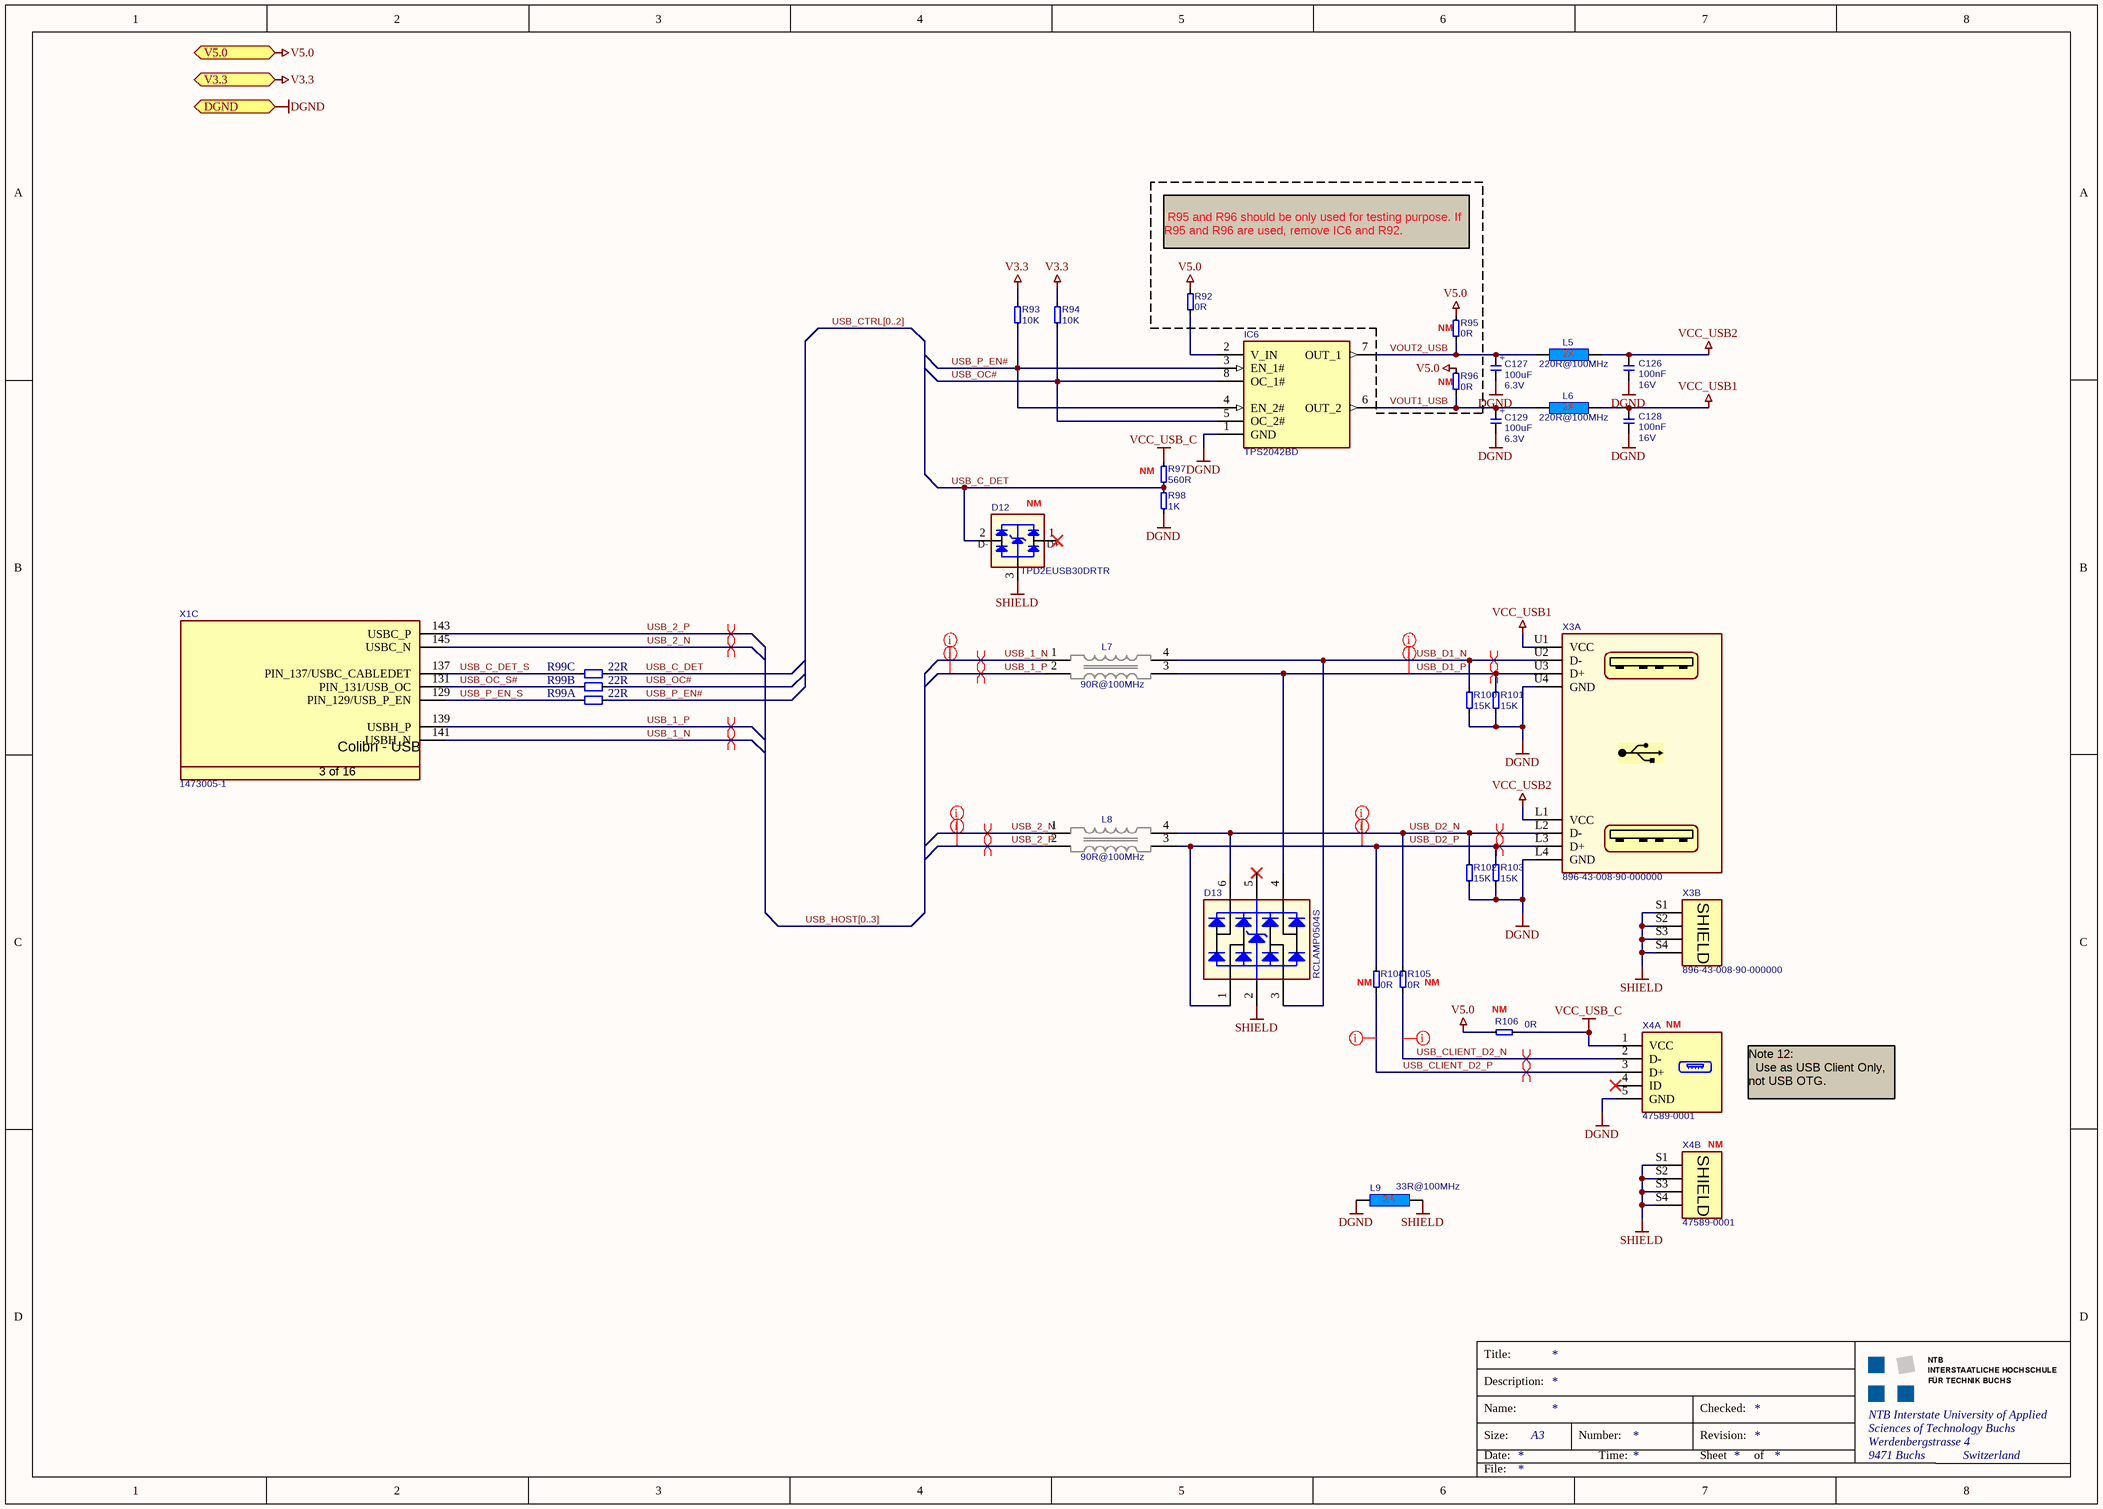
[diagram p7: SOM_USB.SchDoc]

### Parts
C126  Rating: 16V  [0603_3D]  (hidden comment: 100nF)
C127  Rating: 6.3V  [1206_Pol]  (hidden comment: 100uF)
C128  Rating: 16V  [0603_3D]  (hidden comment: 100nF)
C129  Rating: 6.3V  [1206_Pol]  (hidden comment: 100uF)
D12  TPD2EUSB30DRTR  [T_TI_TPD2EUSB30DRTR]
D13  RCLAMP0504S  [T_SOT95P285X90-6N]
IC6  TPS2042BD  [SOIC127P600X173-8N]
L5  220R@100MHz  [0603_3D]
L6  220R@100MHz  [0603_3D]
L7  90R@100MHz  [T_Murata_DLW21HN900SQ2]
L8  90R@100MHz  [T_Murata_DLW21HN900SQ2]
L9  33R@100MHz  [0603_3D]
R92  0R  [0603_3D]
R93  10K  [0603_3D]
R94  10K  [0603_3D]
R95  0R  [0603_3D]
R96  0R  [0603_3D]
R97  560R  [0603_3D]
R98  1K  [0603_3D]
R99  value 22R  [R_Array_CAT16-J4]  (hidden comment: R Array)  (parts A,B,C of 4)
R100  15K  [0603_3D]
R101  15K  [0603_3D]
R102  15K  [0603_3D]
R103  15K  [0603_3D]
R104  0R  [0603_3D]
R105  0R  [0603_3D]
R106  0R  [0603_3D]
X1  1473005-1  [T_Tyco_1473005-1]  (part C of 16)
X3  896-43-008-90-000000  [T_MMMC_896-43-008-90-000000]  (parts A,B of 2)
X4  Manufacturer Part Number: 47589-0001  [T_Molex_47589-0001]  (hidden comment: CON-Molex-47589-0001-5-0.65)  (parts A,B of 2)

### Ports
DGND, V3.3, V5.0

### Nets
DGND: C126.1 C127.2 C128.1 C129.2 IC6.1(GND) L9.1 R98.1 R100.1 R101.1 R102.1 R103.1 X3.L4(GND) X3.U4(GND) X4.5(GND) ; port DGND
SHIELD: D12.3 D13.2 L9.2 X3.S1(SHIELD) X3.S2(SHIELD) X3.S3(SHIELD) X3.S4(SHIELD) X4.S1(SHIELD) X4.S2(SHIELD) X4.S3(SHIELD) X4.S4(SHIELD)
V3.3: R93.2 R94.2 ; port V3.3
V5.0: R92.2 R95.2 R96.2 R106.2 ; port V5.0
VCC_USB1: C128.2 L6.2 X3.U1(VCC)
VCC_USB2: C126.2 L5.2 X3.L1(VCC)
VCC_USB_C: R97.2 R106.1 X4.1(VCC)
USB_1_N: L7.1 X1.141(USBH_N)
USB_1_P: L7.2 X1.139(USBH_P)
USB_2_N: L8.1 X1.145(USBC_N)
USB_2_P: L8.2 X1.143(USBC_P)
USB_C_DET: D12.2(D-) R97.1 R98.2 R99.2C
USB_C_DET_S: R99.1C X1.137(PIN_137/USBC_CABLEDET)
USB_CLIENT_D2_N: R105.1 X4.2(D-)
USB_CLIENT_D2_P: R104.1 X4.3(D+)
USB_D1_N: D13.3 L7.4 R100.2 X3.U2(D-)
USB_D1_P: D13.4 L7.3 R101.2 X3.U3(D+)
USB_D2_N: D13.6 L8.4 R102.2 R105.2 X3.L2(D-)
USB_D2_P: D13.1 L8.3 R103.2 R104.2 X3.L3(D+)
USB_OC#: IC6.5(OC_2#) IC6.8(OC_1#) R94.1 R99.2B
USB_OC_S#: R99.1B X1.131(PIN_131/USB_OC)
USB_P_EN#: IC6.3(EN_1#) IC6.4(EN_2#) R93.1 R99.2A
USB_P_EN_S: R99.1A X1.129(PIN_129/USB_P_EN)
VOUT1_USB: C129.1 IC6.6(OUT_2) L6.1 R96.1
VOUT2_USB: C127.1 IC6.7(OUT_1) L5.1 R95.1
NetIC6_2: IC6.2(V_IN) R92.1

Not connected (* = marked no-connect by the designer): D12 1(D+)*; D13 5*; X4 4(ID)*

### Buses and harness runs
bus USB_CTRL[0..2]
bus USB_HOST[0..3]

### Layout directives
differential pair: USB_1_N, USB_1_P, USB_2_N, USB_2_P, USB_CLIENT_D2_N, USB_CLIENT_D2_P, USB_D1_N, USB_D1_P, USB_D2_N, USB_D2_P
net class USB_1: USB_1_N, USB_1_P
net class USB_2: USB_2_N, USB_2_P
net class USB_D2: USB_D2_N, USB_D2_P
net class USB_D1: USB_D1_N, USB_D1_P
net class USB_CLIENT: USB_CLIENT_D2_N, USB_CLIENT_D2_P

### Notes on the sheet
- R95 and R96 should be only used for testing purpose. If R95 and R96 are used, remove IC6 and R92.
- (near R96) NM
- (near R95) NM
- (near D12) NM
- NM
- (near R104) NM
- (near R105) NM
- (near R106) NM
- (near X4) NM
- Note 12:
  Use as USB Client Only,    not USB OTG.
- Title:
- Description:
- Size:
- Date:
- Name:
- Number:
- Time:
- Revision:
- Sheet
- Checked:
- of
- File:
- (in symbol C-TA-100uF-10V-20%-3528) +
- (in symbol CON-Tyco-1473005-1-200-0.6mm, part C) Colibri - USB; 3 of 16
- (in symbol L-33R@100MHz-3A-0603) 3A

### Library data of the parts
C126 C128 = C-X7R-100nF-16V-10%-0603: Capacitor Ceramic X7R 100nF 16V 10% 0603; Manufacturer: Generic; Tolerance: 10%; Type: X7R; Value: 100nF; Manufacturer Part Number: *
C127 C129 = C-TA-100uF-10V-20%-3528: as C64 on sheet PowerSupply; Tolerance: 20%; Type: TA; Value: 100uF; Manufacturer Part Number: *
D12 = D-TI-TPD2EUSB30DRTR: 2 Channel Protection for Super Speed USB3.0; Manufacturer: TI; Manufacturer Part Number: TPD2EUSB30DRTR
D13 = D-Semtech-RClamp0504S-ESD-5V-+/-8KV(Contact)-+/-15KV(Air): TVS Array low cap; Manufacturer: Semtech; Manufacturer Part Number: RCLAMP0504S
IC6 = IC-TI-TPS2042BD: Dual High Side Switch With OC_DET 500mA/CH; Manufacturer: Texas Instruments; Manufacturer Part Number: TPS2042BD
L5 L6 = L-220R@100MHz-2A-25%-0603: 220R@100MHz 2A EMI FILTER; Manufacturer: Generic; Tolerance: 25%; Rating: 2A; Value: 220R@100MHz; Manufacturer Part Number: *
L7 L8 = L-Murata-DLW21HN900SQ2-90R@100MHz-330mA-25%: Common Mode Choke High Speed 90R 330mA; Manufacturer: Murata; Tolerance: 25%; Rating: 330mA; Value: 90R@100MHz; Manufacturer Part Number: DLW21HN900SQ2
L9 = L-33R@100MHz-3A-0603: 33R@100MHz 3A EMI FILTER; Manufacturer: Generic; Rating: 2A; Tolerance: 25%; Manufacturer Part Number: *; Value: 33R@100MHz
R92 = R-0R-63mW-1%-1206: Resistor 0 ohm 63mW 1%1206 Jumper; Manufacturer: Generic; Tolerance: 1%; Rating: 63mW; Value: 0R; Manufacturer Part Number: *
R93 R94 = R-10KR-63mW-1%-0603: Resistor 10 Kohm 63mW 1% 0603; Manufacturer: Generic; Rating: 63mW; Tolerance: 1%; Value: 10K; Manufacturer Part Number: *
R95 R96 R104-R106 = R-0R-100mW-JP-0603: Resistor 0 ohm 100mW Jumper 0603; Manufacturer: Generic; Rating: 63mW; Tolerance: 1%; Value: 0R; Manufacturer Part Number: *
R97 = R-560R-63mW-5%-0603: Resistor 560 ohm 63mW 5% 0603; Manufacturer: Generic; Rating: 63mW; Tolerance: 5%; Value: 560R; Manufacturer Part Number: *
R98 = R-1KR-63mW-5%-0603: Resistor 1 Kohm 63mW 5% 0603; Manufacturer: Generic; Rating: 63mW; Tolerance: 5%; Value: 1K; Manufacturer Part Number: *
R99 = R_Array
R100-R103 = R-15KR-63mW-1%-0603: Resistor 15 Kohm 63mW 5% 0603; Manufacturer: Generic; Value: 15KR; Rating: 63mW; Tolerance: 5%; Manufacturer Part Number: *
X1 = CON-Tyco-1473005-1-200-0.6mm: SODIMM Connector; Manufacturer: Tyco; No. of ways: 200; Manufacturer Part Number: 1473005-1
X3 = CON-MMMC-896-43-008-90-000000: USB 2.0 double row, Type A; Manufacturer: Mill-Max Mfg. Corp.; No. of ways: 8; Manufacturer Part Number: 896-43-008-90-000000
X4 = CON-Molex-47589-0001-5-0.65: Micro USB OTG Connector; Manufacturer: Molex; No. of ways: 5

## Sheet AnalogOut.SchDoc
size A4; CompanyName: NTB; Organization: NTB Interstate University of Applied; Address1: Werdenbergstrasse 4; Address3: 9471 Buchs; Address4: Switzerland; Organization1: Sciences of Technology Buchs; Size: A4
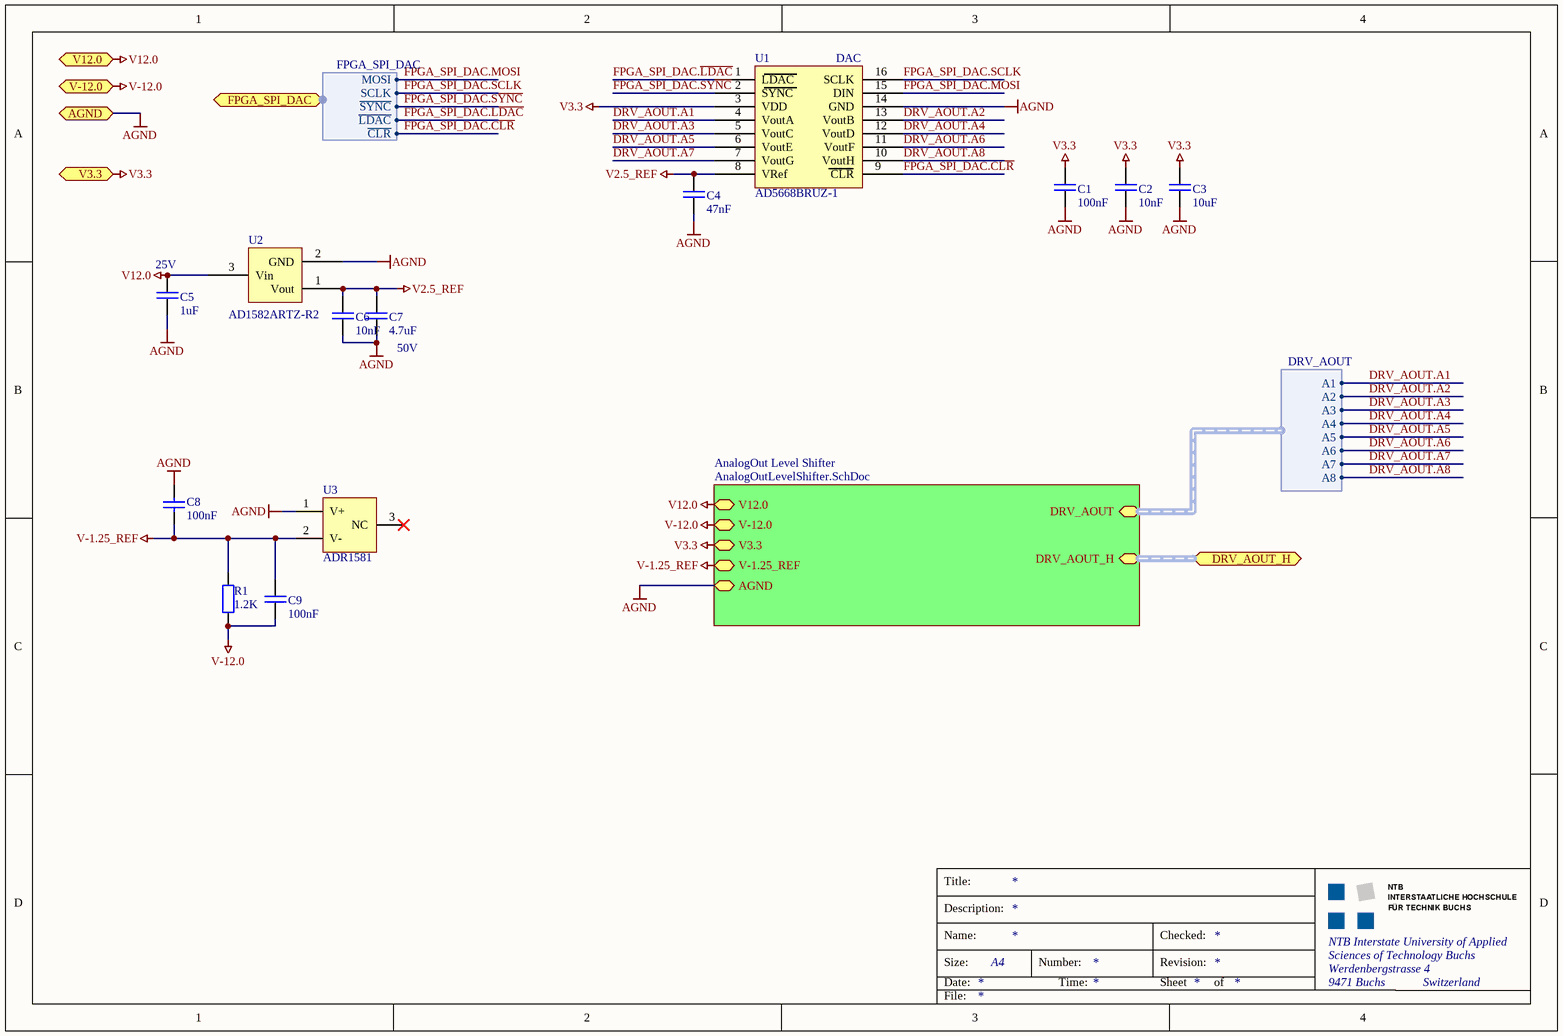
[diagram p8: AnalogOut.SchDoc]

### Parts
C1  100nF  [0603_3D]
C2  10nF  [0603_3D]
C3  10uF  [0603_3D]
C4  47nF  [0603_3D]
C5  Voltage Maximum: 25V  [0603_3D]  (hidden comment: 1uF)
C6  10nF  [0603_3D]
C7  Voltage Maximum: 50V  [1206]  (hidden comment: 4.7uF)
C8  100nF  [0603_3D]
C9  100nF  [0603_3D]
R1  1.2K  [0603]
U1  AD5668BRUZ-1  [TSSOP16-W]
U2  AD1582ARTZ-R2  [SOT23]
U3  ADR1581  [SOT23]

### Sub-sheets
AnalogOut Level Shifter = AnalogOutLevelShifter.SchDoc: DRV_AOUT_H (harness DRV_AOUT_H), V12.0, V-12.0, V3.3, AGND, V-1.25_REF, DRV_AOUT (harness DRV_AOUT)

### Ports
AGND, DRV_AOUT_H (harness DRV_AOUT_H), FPGA_SPI_DAC (harness FPGA_SPI_DAC), V3.3, V12.0, V-12.0

### Harnesses
FPGA_SPI_DAC: MOSI, SCLK, ~{SYNC}, ~{LDAC}, ~{CLR}
DRV_AOUT: A1, A2, A3, A4, A5, A6, A7, A8

### Nets
AGND: C1.2 C2.2 C3.2 C4.2 C5.1 C6.2 C7.2 C8.2 U1.14(GND) U2.2(GND) U3.1(V+) ; port AGND, sheet AnalogOut Level Shifter/AGND
V2.5_REF: C4.1 C6.1 C7.1 U1.8(VRef) U2.1(Vout)
V3.3: C1.1 C2.1 C3.1 U1.3(VDD) ; port V3.3, sheet AnalogOut Level Shifter/V3.3
V12.0: C5.2 U2.3(Vin) ; port V12.0, sheet AnalogOut Level Shifter/V12.0
V-1.25_REF: C8.1 C9.2 R1.2 U3.2(V-) ; sheet AnalogOut Level Shifter/V-1.25_REF
V-12.0: C9.1 R1.1 ; port V-12.0, sheet AnalogOut Level Shifter/V-12.0
DRV_AOUT.A1: U1.4(VoutA) ; sheet AnalogOut Level Shifter/DRV_AOUT.A1
DRV_AOUT.A2: U1.13(VoutB) ; sheet AnalogOut Level Shifter/DRV_AOUT.A2
DRV_AOUT.A3: U1.5(VoutC) ; sheet AnalogOut Level Shifter/DRV_AOUT.A3
DRV_AOUT.A4: U1.12(VoutD) ; sheet AnalogOut Level Shifter/DRV_AOUT.A4
DRV_AOUT.A5: U1.6(VoutE) ; sheet AnalogOut Level Shifter/DRV_AOUT.A5
DRV_AOUT.A6: U1.11(VoutF) ; sheet AnalogOut Level Shifter/DRV_AOUT.A6
DRV_AOUT.A7: U1.7(VoutG) ; sheet AnalogOut Level Shifter/DRV_AOUT.A7
DRV_AOUT.A8: U1.10(VoutH) ; sheet AnalogOut Level Shifter/DRV_AOUT.A8
FPGA_SPI_DAC.~{CLR}: U1.9(CLR) ; port FPGA_SPI_DAC.~{CLR}
FPGA_SPI_DAC.~{LDAC}: U1.1(LDAC) ; port FPGA_SPI_DAC.~{LDAC}
FPGA_SPI_DAC.MOSI: U1.15(DIN) ; port FPGA_SPI_DAC.MOSI
FPGA_SPI_DAC.~{SYNC}: U1.2(SYNC) ; port FPGA_SPI_DAC.~{SYNC}
FPGA_SPI_DAC.SCLK: U1.16(SCLK) ; port FPGA_SPI_DAC.SCLK

Not connected (* = marked no-connect by the designer): U3 3(NC)*

### Buses and harness runs
harness port DRV_AOUT_H = sheet AnalogOut Level Shifter/DRV_AOUT_H

### Notes on the sheet
- (near U1) DAC
- Title:
- Description:
- Size:
- Date:
- Name:
- Number:
- Time:
- Revision:
- Sheet
- Checked:
- of
- File:

### Library data of the parts
C1-C4 C6 C9 = C: Capacitor; #Manufacturer: Generic Components; #Publisher: Dr. A. Heinzelmann; #Class: Passive; Initial Voltage: 0V; Voltage Maximum: ??? V; #Published: 2006-10-07; #ClassSub: Capacitor
  C1 C9: Value: 100nF
  C2 C6: Value: 10nF
  C3: Value: 10uF
  C4: Value: 47nF
C5 C7 C8 = C: as C66 on sheet PowerSupply; #Published: 2006-10-07; #ClassSub: Capacitor
  C5: Value: 1uF
  C7: Value: 4.7uF
  C8: Type: *; Value: 100nF; Voltage Maximum: *
R1 = R: as R12 on sheet PowerSupply; #Published: 2006-10-06; #ClassSub: Resistor; Value: 1.2K

## Sheet AnalogOutLevelShifter.SchDoc: Analog Out Level Shifter
size A4; Author: A. Kalberer; CompanyName: NTB; Organization: NTB Interstate University of Applied; Address1: Werdenbergstrasse 4; Address3: 9471 Buchs; Address4: Switzerland; Revision: 0.1; Organization1: Sciences of Technology Buchs; Size: A4; ShortDescription: +/-10V level shifter for analog out
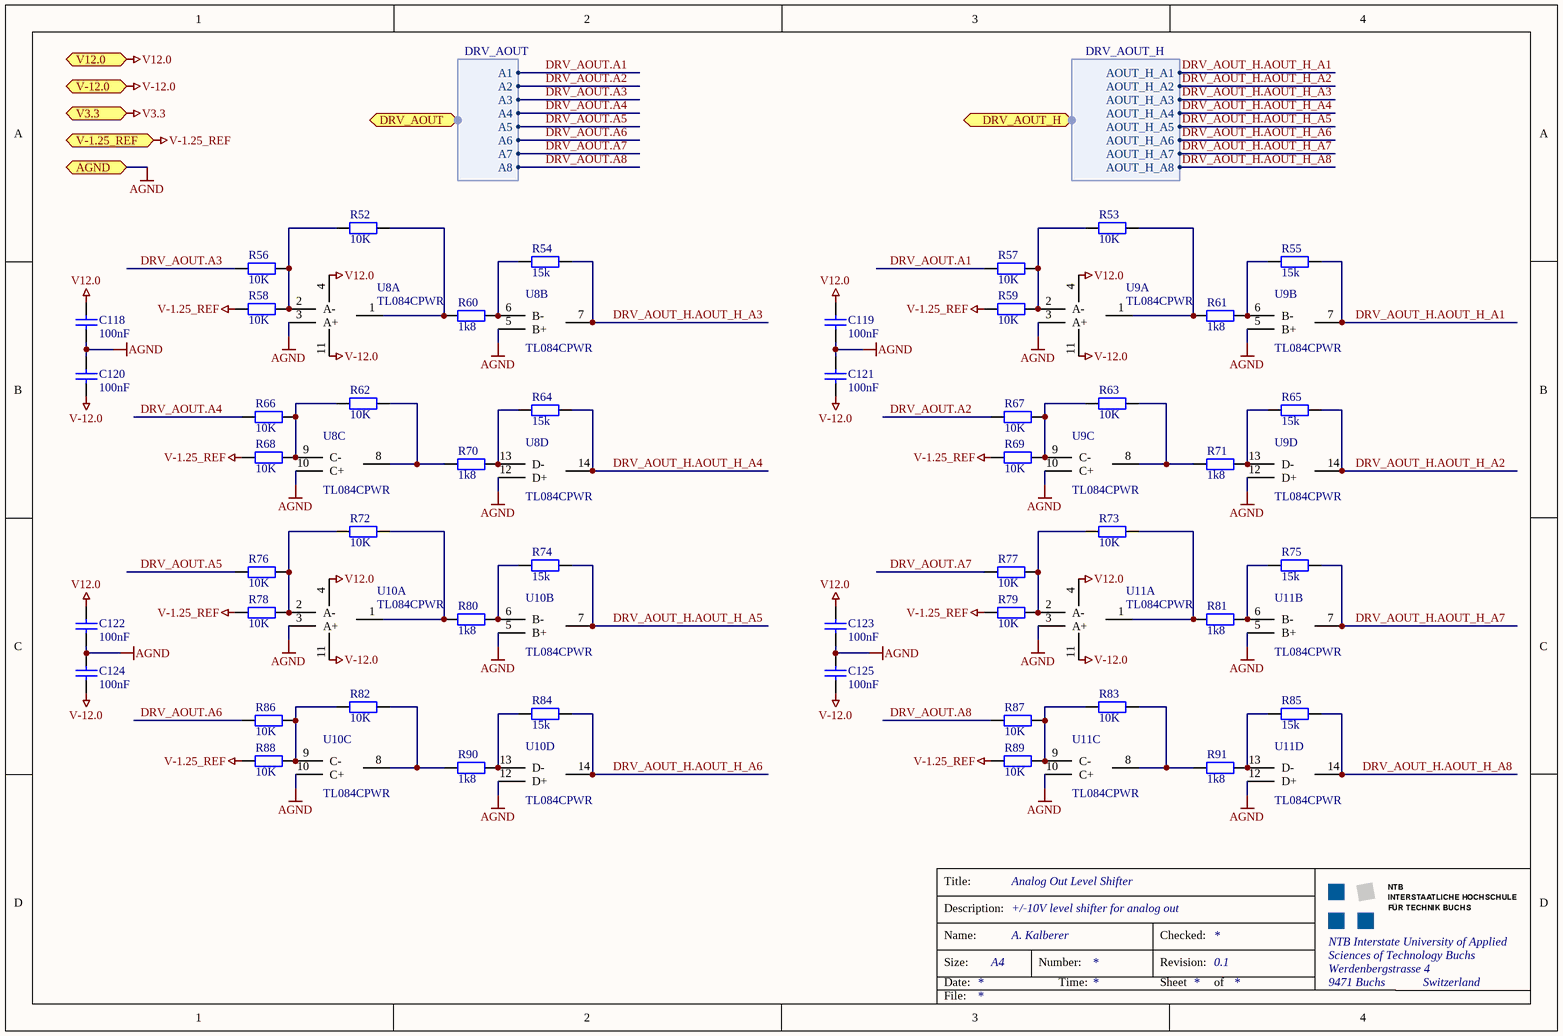
[diagram p9: AnalogOutLevelShifter.SchDoc]

### Parts
C118  100nF  [0603_3D]
C119  100nF  [0603_3D]
C120  100nF  [0603_3D]
C121  100nF  [0603_3D]
C122  100nF  [0603_3D]
C123  100nF  [0603_3D]
C124  100nF  [0603_3D]
C125  100nF  [0603_3D]
R52  10K  [0603_3D]
R53  10K  [0603_3D]
R54  15k  [0603_3D]
R55  15k  [0603_3D]
R56  10K  [0603_3D]
R57  10K  [0603_3D]
R58  10K  [0603_3D]
R59  10K  [0603_3D]
R60  1k8  [0603_3D]
R61  1k8  [0603_3D]
R62  10K  [0603_3D]
R63  10K  [0603_3D]
R64  15k  [0603_3D]
R65  15k  [0603_3D]
R66  10K  [0603_3D]
R67  10K  [0603_3D]
R68  10K  [0603_3D]
R69  10K  [0603_3D]
R70  1k8  [0603_3D]
R71  1k8  [0603_3D]
R72  10K  [0603_3D]
R73  10K  [0603_3D]
R74  15k  [0603_3D]
R75  15k  [0603_3D]
R76  10K  [0603_3D]
R77  10K  [0603_3D]
R78  10K  [0603_3D]
R79  10K  [0603_3D]
R80  1k8  [0603_3D]
R81  1k8  [0603_3D]
R82  10K  [0603_3D]
R83  10K  [0603_3D]
R84  15k  [0603_3D]
R85  15k  [0603_3D]
R86  10K  [0603_3D]
R87  10K  [0603_3D]
R88  10K  [0603_3D]
R89  10K  [0603_3D]
R90  1k8  [0603_3D]
R91  1k8  [0603_3D]
U8  TL084CPWR  [TSOP65P640X120-14N]  (parts A,B,C,D of 4)
U9  TL084CPWR  [TSOP65P640X120-14N]  (parts A,B,C,D of 4)
U10  TL084CPWR  [TSOP65P640X120-14N]  (parts A,B,C,D of 4)
U11  TL084CPWR  [TSOP65P640X120-14N]  (parts A,B,C,D of 4)

### Ports
AGND, DRV_AOUT (harness DRV_AOUT), DRV_AOUT_H (harness DRV_AOUT_H), V3.3, V12.0, V-1.25_REF, V-12.0

### Harnesses
DRV_AOUT_H: AOUT_H_A1, AOUT_H_A2, AOUT_H_A3, AOUT_H_A4, AOUT_H_A5, AOUT_H_A6, AOUT_H_A7, AOUT_H_A8
DRV_AOUT: A1, A2, A3, A4, A5, A6, A7, A8

### Nets
AGND: C118.1 C119.1 C120.2 C121.2 C122.1 C123.1 C124.2 C125.2 U8.3(A+) U8.5(B+) U8.10(C+) U8.12(D+) U9.3(A+) U9.5(B+) U9.10(C+) U9.12(D+) U10.3(A+) U10.5(B+) U10.10(C+) U10.12(D+) U11.3(A+) U11.5(B+) U11.10(C+) U11.12(D+) ; port AGND
V12.0: C118.2 C119.2 C122.2 C123.2 U8.4(V+) U9.4(V+) U10.4(V+) U11.4(V+) ; port V12.0
V-1.25_REF: R58.1 R59.1 R68.1 R69.1 R78.1 R79.1 R88.1 R89.1 ; port V-1.25_REF
V-12.0: C120.1 C121.1 C124.1 C125.1 U8.11(V-) U9.11(V-) U10.11(V-) U11.11(V-) ; port V-12.0
DRV_AOUT.A1: R57.1 ; port DRV_AOUT.A1
DRV_AOUT.A2: R67.1 ; port DRV_AOUT.A2
DRV_AOUT.A3: R56.1 ; port DRV_AOUT.A3
DRV_AOUT.A4: R66.1 ; port DRV_AOUT.A4
DRV_AOUT.A5: R76.1 ; port DRV_AOUT.A5
DRV_AOUT.A6: R86.1 ; port DRV_AOUT.A6
DRV_AOUT.A7: R77.1 ; port DRV_AOUT.A7
DRV_AOUT.A8: R87.1 ; port DRV_AOUT.A8
DRV_AOUT_H.AOUT_H_A1: R55.2 U9.7(Bout) ; port DRV_AOUT_H.AOUT_H_A1
DRV_AOUT_H.AOUT_H_A2: R65.2 U9.14(Dout) ; port DRV_AOUT_H.AOUT_H_A2
DRV_AOUT_H.AOUT_H_A3: R54.2 U8.7(Bout) ; port DRV_AOUT_H.AOUT_H_A3
DRV_AOUT_H.AOUT_H_A4: R64.2 U8.14(Dout) ; port DRV_AOUT_H.AOUT_H_A4
DRV_AOUT_H.AOUT_H_A5: R74.2 U10.7(Bout) ; port DRV_AOUT_H.AOUT_H_A5
DRV_AOUT_H.AOUT_H_A6: R84.2 U10.14(Dout) ; port DRV_AOUT_H.AOUT_H_A6
DRV_AOUT_H.AOUT_H_A7: R75.2 U11.7(Bout) ; port DRV_AOUT_H.AOUT_H_A7
DRV_AOUT_H.AOUT_H_A8: R85.2 U11.14(Dout) ; port DRV_AOUT_H.AOUT_H_A8
NetR52_1: R52.1 R56.2 R58.2 U8.2(A-)
NetR52_2: R52.2 R60.1 U8.1(Aout)
NetR53_1: R53.1 R57.2 R59.2 U9.2(A-)
NetR53_2: R53.2 R61.1 U9.1(Aout)
NetR54_1: R54.1 R60.2 U8.6(B-)
NetR55_1: R55.1 R61.2 U9.6(B-)
NetR62_1: R62.1 R66.2 R68.2 U8.9(C-)
NetR62_2: R62.2 R70.1 U8.8(Cout)
NetR63_1: R63.1 R67.2 R69.2 U9.9(C-)
NetR63_2: R63.2 R71.1 U9.8(Cout)
NetR64_1: R64.1 R70.2 U8.13(D-)
NetR65_1: R65.1 R71.2 U9.13(D-)
NetR72_1: R72.1 R76.2 R78.2 U10.2(A-)
NetR72_2: R72.2 R80.1 U10.1(Aout)
NetR73_1: R73.1 R77.2 R79.2 U11.2(A-)
NetR73_2: R73.2 R81.1 U11.1(Aout)
NetR74_1: R74.1 R80.2 U10.6(B-)
NetR75_1: R75.1 R81.2 U11.6(B-)
NetR82_1: R82.1 R86.2 R88.2 U10.9(C-)
NetR82_2: R82.2 R90.1 U10.8(Cout)
NetR83_1: R83.1 R87.2 R89.2 U11.9(C-)
NetR83_2: R83.2 R91.1 U11.8(Cout)
NetR84_1: R84.1 R90.2 U10.13(D-)
NetR85_1: R85.1 R91.2 U11.13(D-)

### Notes on the sheet
- Title:
- Description:
- Size:
- Date:
- Name:
- Number:
- Time:
- Revision:
- Sheet
- Checked:
- of
- File:

### Library data of the parts
C118-C125 = C: as C66 on sheet PowerSupply; #Published: 2006-10-07; #ClassSub: Capacitor; Type: *; Value: 100nF; Voltage Maximum: *
R52-R91 = R: as R12 on sheet PowerSupply; #Published: 2006-10-06; #ClassSub: Resistor
  R52 R53 R56-R59 R62 R63 R66-R69 R72 R73 R76-R79 R82 R83 R86-R89: Value: 10K
  R54 R55 R64 R65 R74 R75 R84 R85: Value: 15k
  R60 R61 R70 R71 R80 R81 R90 R91: Value: 1k8
U8-U11 = TL084CPWR: Quad OPAmp

## Sheet DriveConnector.SchDoc
size A4; CompanyName: NTB; Organization: NTB Interstate University of Applied; Address1: Werdenbergstrasse 4; Address3: 9471 Buchs; Address4: Switzerland; Organization1: Sciences of Technology Buchs; Size: A4
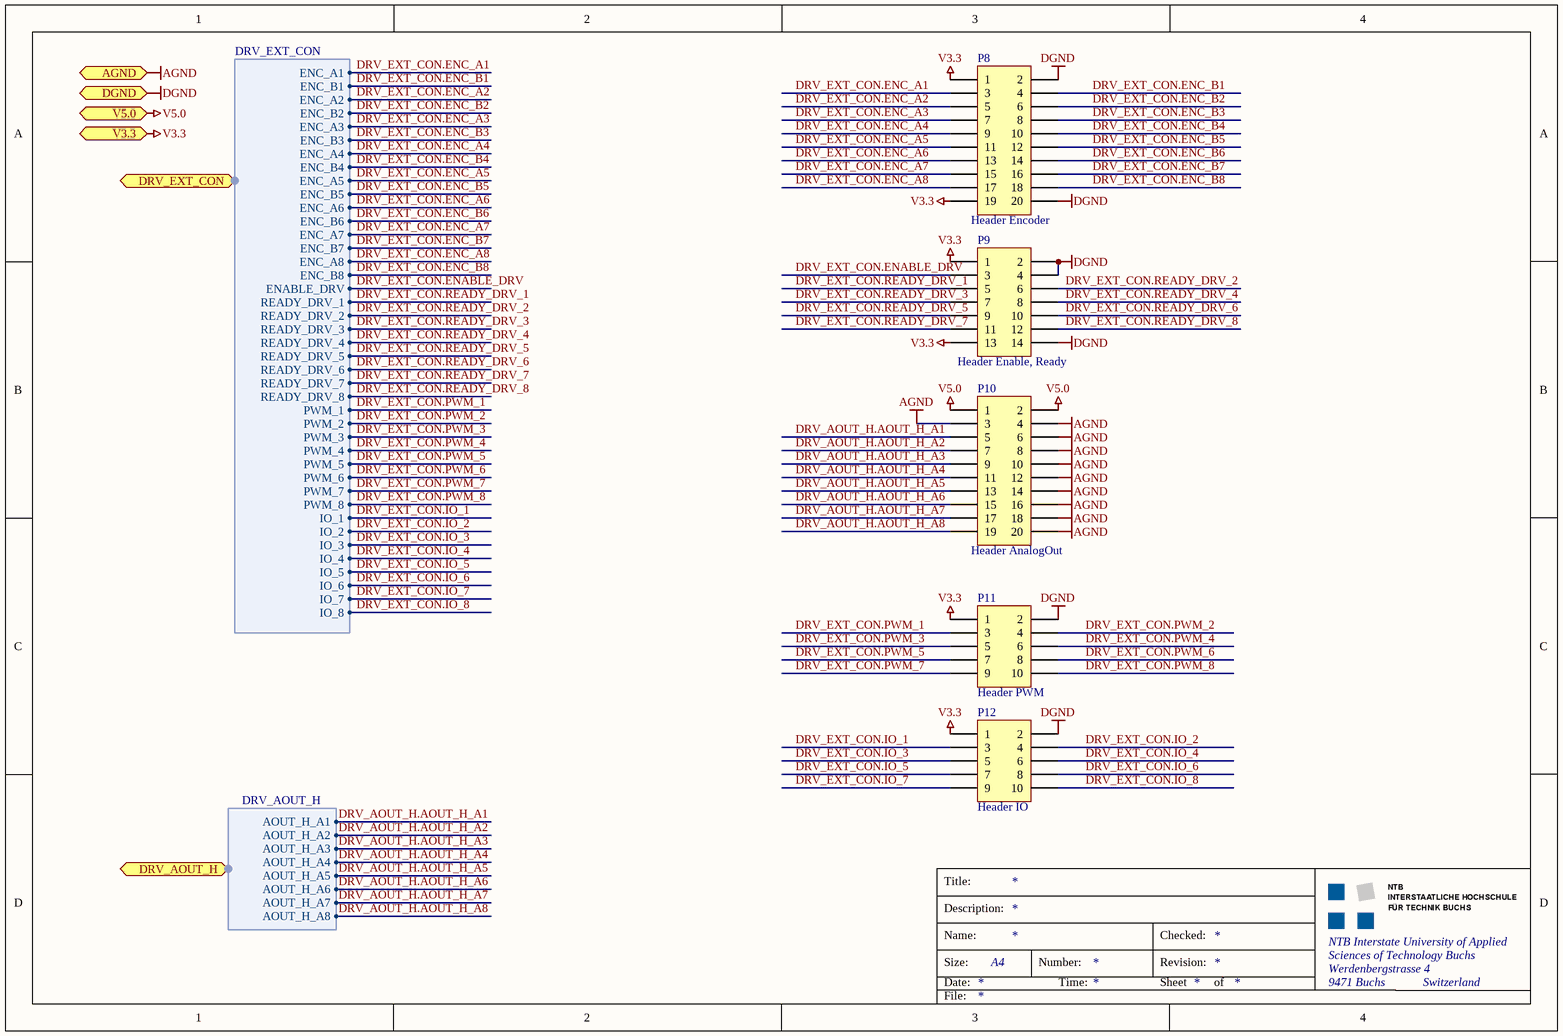
[diagram p10: DriveConnector.SchDoc]

### Parts
P8  Header Encoder  [Wannenstecker 2x10 - H]
P9  Header Enable, Ready  [Wannenstecker 2x7 - H]
P10  Header AnalogOut  [Wannenstecker 2x10 - H]
P11  Header PWM  [Wannenstecker 2x5 - H]
P12  Header IO  [Wannenstecker 2x5 - H]

### Ports
AGND, DGND, DRV_AOUT_H (harness DRV_AOUT_H), DRV_EXT_CON (harness DRV_EXT_CON), V3.3, V5.0

### Harnesses
DRV_AOUT_H: AOUT_H_A1, AOUT_H_A2, AOUT_H_A3, AOUT_H_A4, AOUT_H_A5, AOUT_H_A6, AOUT_H_A7, AOUT_H_A8
DRV_EXT_CON: ENC_A1, ENC_B1, ENC_A2, ENC_B2, ENC_A3, ENC_B3, ENC_A4, ENC_B4, ENC_A5, ENC_B5, ENC_A6, ENC_B6, ENC_A7, ENC_B7, ENC_A8, ENC_B8, PWM_1, ENABLE_DRV, READY_DRV_4, READY_DRV_3, READY_DRV_2, READY_DRV_1, IO_1, IO_2, READY_DRV_5, READY_DRV_6, READY_DRV_7, READY_DRV_8, PWM_2, PWM_3, PWM_4, PWM_5, PWM_6, PWM_7, PWM_8, IO_3, IO_4, IO_5, IO_6, IO_7, IO_8

### Nets
AGND: P10.3 P10.4 P10.6 P10.8 P10.10 P10.12 P10.14 P10.16 P10.18 P10.20 ; port AGND
DGND: P8.2 P8.20 P9.2 P9.4 P9.14 P11.2 P12.2 ; port DGND
V3.3: P8.1 P8.19 P9.1 P9.13 P11.1 P12.1 ; port V3.3
V5.0: P10.1 P10.2 ; port V5.0
DRV_AOUT_H.AOUT_H_A1: P10.5 ; port DRV_AOUT_H.AOUT_H_A1
DRV_AOUT_H.AOUT_H_A2: P10.7 ; port DRV_AOUT_H.AOUT_H_A2
DRV_AOUT_H.AOUT_H_A3: P10.9 ; port DRV_AOUT_H.AOUT_H_A3
DRV_AOUT_H.AOUT_H_A4: P10.11 ; port DRV_AOUT_H.AOUT_H_A4
DRV_AOUT_H.AOUT_H_A5: P10.13 ; port DRV_AOUT_H.AOUT_H_A5
DRV_AOUT_H.AOUT_H_A6: P10.15 ; port DRV_AOUT_H.AOUT_H_A6
DRV_AOUT_H.AOUT_H_A7: P10.17 ; port DRV_AOUT_H.AOUT_H_A7
DRV_AOUT_H.AOUT_H_A8: P10.19 ; port DRV_AOUT_H.AOUT_H_A8
DRV_EXT_CON.ENABLE_DRV: P9.3 ; port DRV_EXT_CON.ENABLE_DRV
DRV_EXT_CON.ENC_A1: P8.3 ; port DRV_EXT_CON.ENC_A1
DRV_EXT_CON.ENC_A2: P8.5 ; port DRV_EXT_CON.ENC_A2
DRV_EXT_CON.ENC_A3: P8.7 ; port DRV_EXT_CON.ENC_A3
DRV_EXT_CON.ENC_A4: P8.9 ; port DRV_EXT_CON.ENC_A4
DRV_EXT_CON.ENC_A5: P8.11 ; port DRV_EXT_CON.ENC_A5
DRV_EXT_CON.ENC_A6: P8.13 ; port DRV_EXT_CON.ENC_A6
DRV_EXT_CON.ENC_A7: P8.15 ; port DRV_EXT_CON.ENC_A7
DRV_EXT_CON.ENC_A8: P8.17 ; port DRV_EXT_CON.ENC_A8
DRV_EXT_CON.ENC_B1: P8.4 ; port DRV_EXT_CON.ENC_B1
DRV_EXT_CON.ENC_B2: P8.6 ; port DRV_EXT_CON.ENC_B2
DRV_EXT_CON.ENC_B3: P8.8 ; port DRV_EXT_CON.ENC_B3
DRV_EXT_CON.ENC_B4: P8.10 ; port DRV_EXT_CON.ENC_B4
DRV_EXT_CON.ENC_B5: P8.12 ; port DRV_EXT_CON.ENC_B5
DRV_EXT_CON.ENC_B6: P8.14 ; port DRV_EXT_CON.ENC_B6
DRV_EXT_CON.ENC_B7: P8.16 ; port DRV_EXT_CON.ENC_B7
DRV_EXT_CON.ENC_B8: P8.18 ; port DRV_EXT_CON.ENC_B8
DRV_EXT_CON.IO_1: P12.3 ; port DRV_EXT_CON.IO_1
DRV_EXT_CON.IO_2: P12.4 ; port DRV_EXT_CON.IO_2
DRV_EXT_CON.IO_3: P12.5 ; port DRV_EXT_CON.IO_3
DRV_EXT_CON.IO_4: P12.6 ; port DRV_EXT_CON.IO_4
DRV_EXT_CON.IO_5: P12.7 ; port DRV_EXT_CON.IO_5
DRV_EXT_CON.IO_6: P12.8 ; port DRV_EXT_CON.IO_6
DRV_EXT_CON.IO_7: P12.9 ; port DRV_EXT_CON.IO_7
DRV_EXT_CON.IO_8: P12.10 ; port DRV_EXT_CON.IO_8
DRV_EXT_CON.PWM_1: P11.3 ; port DRV_EXT_CON.PWM_1
DRV_EXT_CON.PWM_2: P11.4 ; port DRV_EXT_CON.PWM_2
DRV_EXT_CON.PWM_3: P11.5 ; port DRV_EXT_CON.PWM_3
DRV_EXT_CON.PWM_4: P11.6 ; port DRV_EXT_CON.PWM_4
DRV_EXT_CON.PWM_5: P11.7 ; port DRV_EXT_CON.PWM_5
DRV_EXT_CON.PWM_6: P11.8 ; port DRV_EXT_CON.PWM_6
DRV_EXT_CON.PWM_7: P11.9 ; port DRV_EXT_CON.PWM_7
DRV_EXT_CON.PWM_8: P11.10 ; port DRV_EXT_CON.PWM_8
DRV_EXT_CON.READY_DRV_1: P9.5 ; port DRV_EXT_CON.READY_DRV_1
DRV_EXT_CON.READY_DRV_2: P9.6 ; port DRV_EXT_CON.READY_DRV_2
DRV_EXT_CON.READY_DRV_3: P9.7 ; port DRV_EXT_CON.READY_DRV_3
DRV_EXT_CON.READY_DRV_4: P9.8 ; port DRV_EXT_CON.READY_DRV_4
DRV_EXT_CON.READY_DRV_5: P9.9 ; port DRV_EXT_CON.READY_DRV_5
DRV_EXT_CON.READY_DRV_6: P9.10 ; port DRV_EXT_CON.READY_DRV_6
DRV_EXT_CON.READY_DRV_7: P9.11 ; port DRV_EXT_CON.READY_DRV_7
DRV_EXT_CON.READY_DRV_8: P9.12 ; port DRV_EXT_CON.READY_DRV_8

### Notes on the sheet
- Title:
- Description:
- Size:
- Date:
- Name:
- Number:
- Time:
- Revision:
- Sheet
- Checked:
- of
- File:

### Library data of the parts
P8 P10 = Header 10X2: Header, 10-Pin, Dual row; LatestRevisionDate: 17-Jul-2002; LatestRevisionNote: Re-released for DXP Platform.; Publisher: Altium Limited
P9 = Header 2x7: Header, 7-Pin, Dual row; LatestRevisionDate: 17-Jul-2002; LatestRevisionNote: Re-released for DXP Platform.; Publisher: Altium Limited
P11 P12 = Header 5X2: Header, 5-Pin, Dual row; LatestRevisionDate: 17-Jul-2002; LatestRevisionNote: Re-released for DXP Platform.; Publisher: Altium Limited

## Nets that join several sheets
AGND: ControllerBoardExp (GND1.3), AnalogOut (11 pins), AnalogOutLevelShifter (24 pins), DriveConnector (10 pins)
CAN_GND: ControllerBoardExp (GND1.1), PowerSupply (9 pins), SOM_CAN (C89.1 IC5.1)
DGND: ControllerBoardExp (GND1.2), PowerSupply (16 pins), FPGA_Config (7 pins), SOM_CAN (6 pins), SOM_USB (14 pins), DriveConnector (7 pins)
V2.5: PowerSupply (6 pins), FPGA_Config (P1.4 R9.2 R10.2)
V3.3: PowerSupply (11 pins), FPGA_Config (R2.2 R3.2 R4.2), SOM_CAN (8 pins), SOM_USB (R93.2 R94.2), AnalogOut (C1.1 C2.1 C3.1 U1.3), DriveConnector (6 pins)
V5.0: PowerSupply (5 pins), SOM_CAN (C89.2 IC5.3), SOM_USB (R92.2 R95.2 R96.2 R106.2), DriveConnector (P10.1 P10.2)
V12.0: PowerSupply (C69.2 P2.4), AnalogOut (C5.2 U2.3), AnalogOutLevelShifter (8 pins)
V-1.25_REF: AnalogOut (C8.1 C9.2 R1.2 U3.2), AnalogOutLevelShifter (8 pins)
V-12.0: PowerSupply (C70.2 P2.5), AnalogOut (C9.1 R1.1), AnalogOutLevelShifter (8 pins)
DRV_AOUT.A1: AnalogOut (U1.4), AnalogOutLevelShifter (R57.1)
DRV_AOUT.A2: AnalogOut (U1.13), AnalogOutLevelShifter (R67.1)
DRV_AOUT.A3: AnalogOut (U1.5), AnalogOutLevelShifter (R56.1)
DRV_AOUT.A4: AnalogOut (U1.12), AnalogOutLevelShifter (R66.1)
DRV_AOUT.A5: AnalogOut (U1.6), AnalogOutLevelShifter (R76.1)
DRV_AOUT.A6: AnalogOut (U1.11), AnalogOutLevelShifter (R86.1)
DRV_AOUT.A7: AnalogOut (U1.7), AnalogOutLevelShifter (R77.1)
DRV_AOUT.A8: AnalogOut (U1.10), AnalogOutLevelShifter (R87.1)
DRV_AOUT_H.AOUT_H_A1: AnalogOutLevelShifter (R55.2 U9.7), DriveConnector (P10.5)
DRV_AOUT_H.AOUT_H_A2: AnalogOutLevelShifter (R65.2 U9.14), DriveConnector (P10.7)
DRV_AOUT_H.AOUT_H_A3: AnalogOutLevelShifter (R54.2 U8.7), DriveConnector (P10.9)
DRV_AOUT_H.AOUT_H_A4: AnalogOutLevelShifter (R64.2 U8.14), DriveConnector (P10.11)
DRV_AOUT_H.AOUT_H_A5: AnalogOutLevelShifter (R74.2 U10.7), DriveConnector (P10.13)
DRV_AOUT_H.AOUT_H_A6: AnalogOutLevelShifter (R84.2 U10.14), DriveConnector (P10.15)
DRV_AOUT_H.AOUT_H_A7: AnalogOutLevelShifter (R75.2 U11.7), DriveConnector (P10.17)
DRV_AOUT_H.AOUT_H_A8: AnalogOutLevelShifter (R85.2 U11.14), DriveConnector (P10.19)
FPGA_SPI_DAC.~{CLR}: FPGA_IO (U4.R5), AnalogOut (U1.9)
FPGA_SPI_DAC.~{LDAC}: FPGA_IO (U4.R6), AnalogOut (U1.1)
FPGA_SPI_DAC.MOSI: FPGA_IO (U4.T7), AnalogOut (U1.15)
FPGA_SPI_DAC.~{SYNC}: FPGA_IO (U4.T6), AnalogOut (U1.2)
FPGA_SPI_DAC.SCLK: FPGA_IO (U4.R7), AnalogOut (U1.16)